# EAGLE schematic UFBmod_2V1 (EAGLE 7.7.0)
UFBmod - the best digital modulation ever created :-)
Assembly variants: Std

## Sheet 1 of 15: FPGA Slot-Left
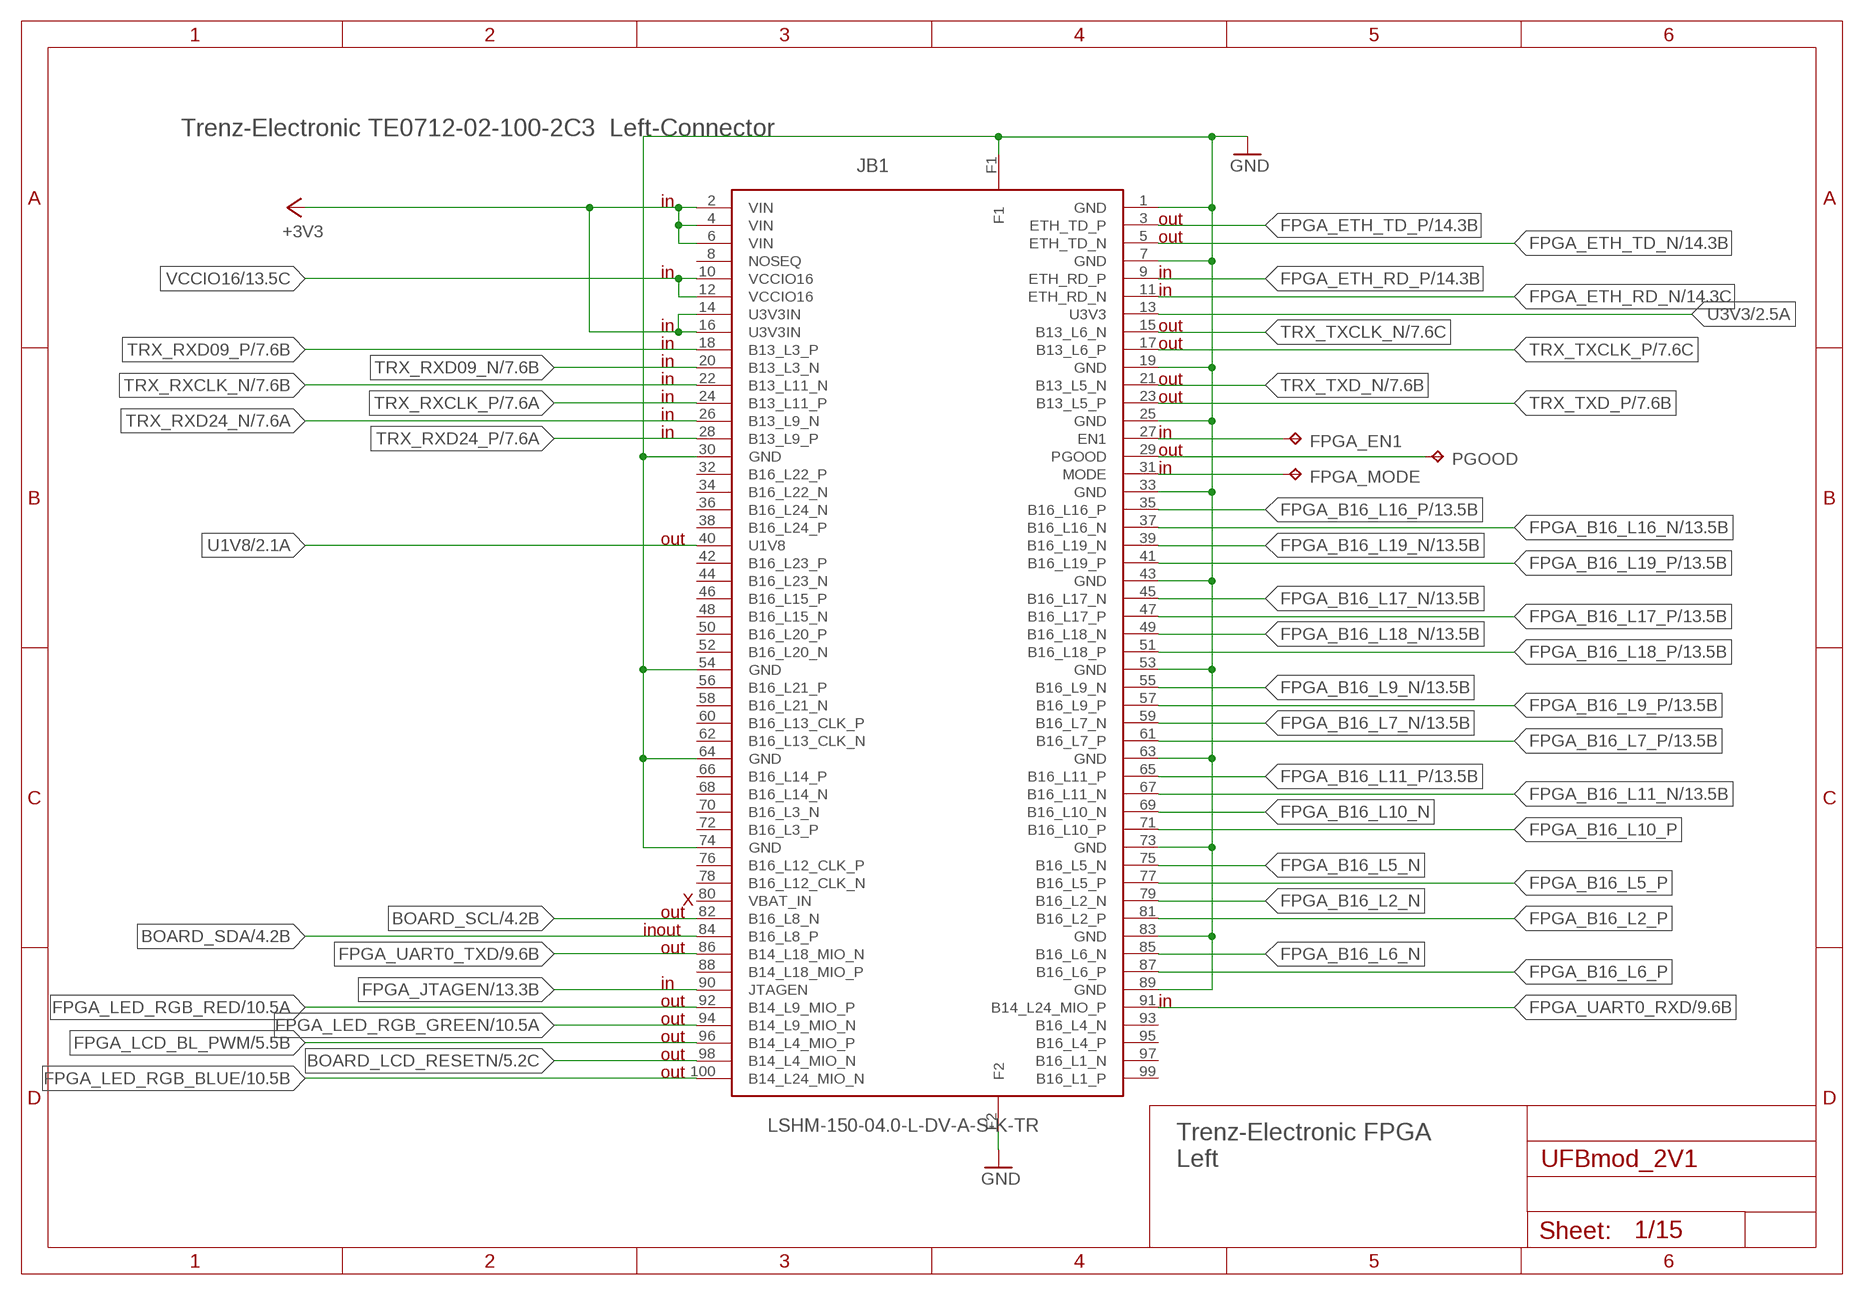
[diagram p0: schematic, sheet 1]

### Parts
FPGA_EN1  TPB1,27  [B1,27]
FPGA_MODE  TPB1,27  [B1,27]
JB1  LSHM-150-04.0-L-DV-A-S-K-TR  SAMTEC_LSHM-150-DV_JB1  [SAMTEC_LSHM-150-DV]
PGOOD  TPB1,27  [B1,27]

### Nets
+3V3: JB1.2(VIN) JB1.4(VIN) JB1.6(VIN) JB1.14(U3V3IN) JB1.16(U3V3IN) ; also sheet 2,4,5,6,7,8,9,11,12,13,14
BOARD_LCD_RESETN: JB1.98(B14_L4_MIO_N) ; also sheet 5
BOARD_SCL: JB1.82(B16_L8_N) ; also sheet 4,5,6
BOARD_SDA: JB1.84(B16_L8_P) ; also sheet 4,5,6
FPGA_B16_L2_N: JB1.79(B16_L2_N)
FPGA_B16_L2_P: JB1.81(B16_L2_P)
FPGA_B16_L5_N: JB1.75(B16_L5_N)
FPGA_B16_L5_P: JB1.77(B16_L5_P)
FPGA_B16_L6_N: JB1.85(B16_L6_N)
FPGA_B16_L6_P: JB1.87(B16_L6_P)
FPGA_B16_L7_N [diff_100R_360u]: JB1.59(B16_L7_N) ; also sheet 13
FPGA_B16_L7_P [diff_100R_360u]: JB1.61(B16_L7_P) ; also sheet 13
FPGA_B16_L9_N: JB1.55(B16_L9_N) ; also sheet 13
FPGA_B16_L9_P [diff_100R_360u]: JB1.57(B16_L9_P) ; also sheet 13
FPGA_B16_L10_N: JB1.69(B16_L10_N)
FPGA_B16_L10_P: JB1.71(B16_L10_P)
FPGA_B16_L11_N [diff_100R_360u]: JB1.67(B16_L11_N) ; also sheet 13
FPGA_B16_L11_P [diff_100R_360u]: JB1.65(B16_L11_P) ; also sheet 13
FPGA_B16_L16_N [diff_100R_360u]: JB1.37(B16_L16_N) ; also sheet 13
FPGA_B16_L16_P [diff_100R_360u]: JB1.35(B16_L16_P) ; also sheet 13
FPGA_B16_L17_N [diff_100R_360u]: JB1.45(B16_L17_N) ; also sheet 13
FPGA_B16_L17_P [diff_100R_360u]: JB1.47(B16_L17_P) ; also sheet 13
FPGA_B16_L18_N [diff_100R_360u]: JB1.49(B16_L18_N) ; also sheet 13
FPGA_B16_L18_P [diff_100R_360u]: JB1.51(B16_L18_P) ; also sheet 13
FPGA_B16_L19_N [diff_100R_360u]: JB1.39(B16_L19_N) ; also sheet 13
FPGA_B16_L19_P [diff_100R_360u]: JB1.41(B16_L19_P) ; also sheet 13
FPGA_EN1: FPGA_EN1.TP JB1.27(EN1)
FPGA_ETH_RD_N [diff_100R_200u]: JB1.11(ETH_RD_N) ; also sheet 14
FPGA_ETH_RD_P [diff_100R_200u]: JB1.9(ETH_RD_P) ; also sheet 14
FPGA_ETH_TD_N [diff_100R_200u]: JB1.5(ETH_TD_N) ; also sheet 14
FPGA_ETH_TD_P [diff_100R_200u]: JB1.3(ETH_TD_P) ; also sheet 14
FPGA_JTAGEN: JB1.90(JTAGEN) ; also sheet 13
FPGA_LCD_BL_PWM: JB1.96(B14_L4_MIO_P) ; also sheet 5
FPGA_LED_RGB_BLUE: JB1.100(B14_L24_MIO_N) ; also sheet 10
FPGA_LED_RGB_GREEN: JB1.94(B14_L9_MIO_N) ; also sheet 10
FPGA_LED_RGB_RED: JB1.92(B14_L9_MIO_P) ; also sheet 10
FPGA_MODE: FPGA_MODE.TP JB1.31(MODE)
FPGA_UART0_RXD: JB1.91(B14_L24_MIO_P) ; also sheet 9
FPGA_UART0_TXD: JB1.86(B14_L18_MIO_N) ; also sheet 9
GND: JB1.1(GND) JB1.7(GND) JB1.19(GND) JB1.25(GND) JB1.30(GND) JB1.33(GND) JB1.43(GND) JB1.53(GND) JB1.54(GND) JB1.63(GND) JB1.64(GND) JB1.73(GND) JB1.74(GND) JB1.83(GND) JB1.89(GND) JB1.F1 JB1.F2 ; also sheet 2,3,5,6,7,8,9,10,11,12,13,14,15
PGOOD: JB1.29(PGOOD) PGOOD.TP
TRX_RXCLK_N [diff_100R_200u]: JB1.22(B13_L11_N) ; also sheet 7
TRX_RXCLK_P [diff_100R_200u]: JB1.24(B13_L11_P) ; also sheet 7
TRX_RXD09_N [diff_100R_200u]: JB1.20(B13_L3_N) ; also sheet 7
TRX_RXD09_P [diff_100R_200u]: JB1.18(B13_L3_P) ; also sheet 7
TRX_RXD24_N [diff_100R_200u]: JB1.26(B13_L9_N) ; also sheet 7
TRX_RXD24_P [diff_100R_200u]: JB1.28(B13_L9_P) ; also sheet 7
TRX_TXCLK_N [diff_100R_200u]: JB1.15(B13_L6_N) ; also sheet 7
TRX_TXCLK_P [diff_100R_200u]: JB1.17(B13_L6_P) ; also sheet 7
TRX_TXD_N [diff_100R_200u]: JB1.21(B13_L5_N) ; also sheet 7
TRX_TXD_P [diff_100R_200u]: JB1.23(B13_L5_P) ; also sheet 7
U1V8: JB1.40(U1V8) ; also sheet 2,13
U3V3: JB1.13(U3V3) ; also sheet 2,12,13
VCCIO16: JB1.10(VCCIO16) JB1.12(VCCIO16) ; also sheet 13
Unconnected: JB1.8(NOSEQ) JB1.32(B16_L22_P) JB1.34(B16_L22_N) JB1.36(B16_L24_N) JB1.38(B16_L24_P) JB1.42(B16_L23_P) JB1.44(B16_L23_N) JB1.46(B16_L15_P) JB1.48(B16_L15_N) JB1.50(B16_L20_P) JB1.52(B16_L20_N) JB1.56(B16_L21_P) JB1.58(B16_L21_N) JB1.60(B16_L13_CLK_P) JB1.62(B16_L13_CLK_N) JB1.66(B16_L14_P) JB1.68(B16_L14_N) JB1.70(B16_L3_N) JB1.72(B16_L3_P) JB1.76(B16_L12_CLK_P) JB1.78(B16_L12_CLK_N) JB1.88(B14_L18_MIO_P) JB1.93(B16_L4_N) JB1.95(B16_L4_P) JB1.97(B16_L1_N) JB1.99(B16_L1_P)

### Notes on the sheet
- Trenz-Electronic TE0712-02-100-2C3  Left-Connector
- in
- out
- out
- in | in
- in
- in | out
- in | out
- in
- in | out
- in | out
- in
- in | in
- out
- in
- out
- X
- out
- inout
- out
- in
- out | in
- out
- out
- out
- out
- Trenz-Electronic FPGA
  Left

## Sheet 2 of 15: FPGA Slot-Right
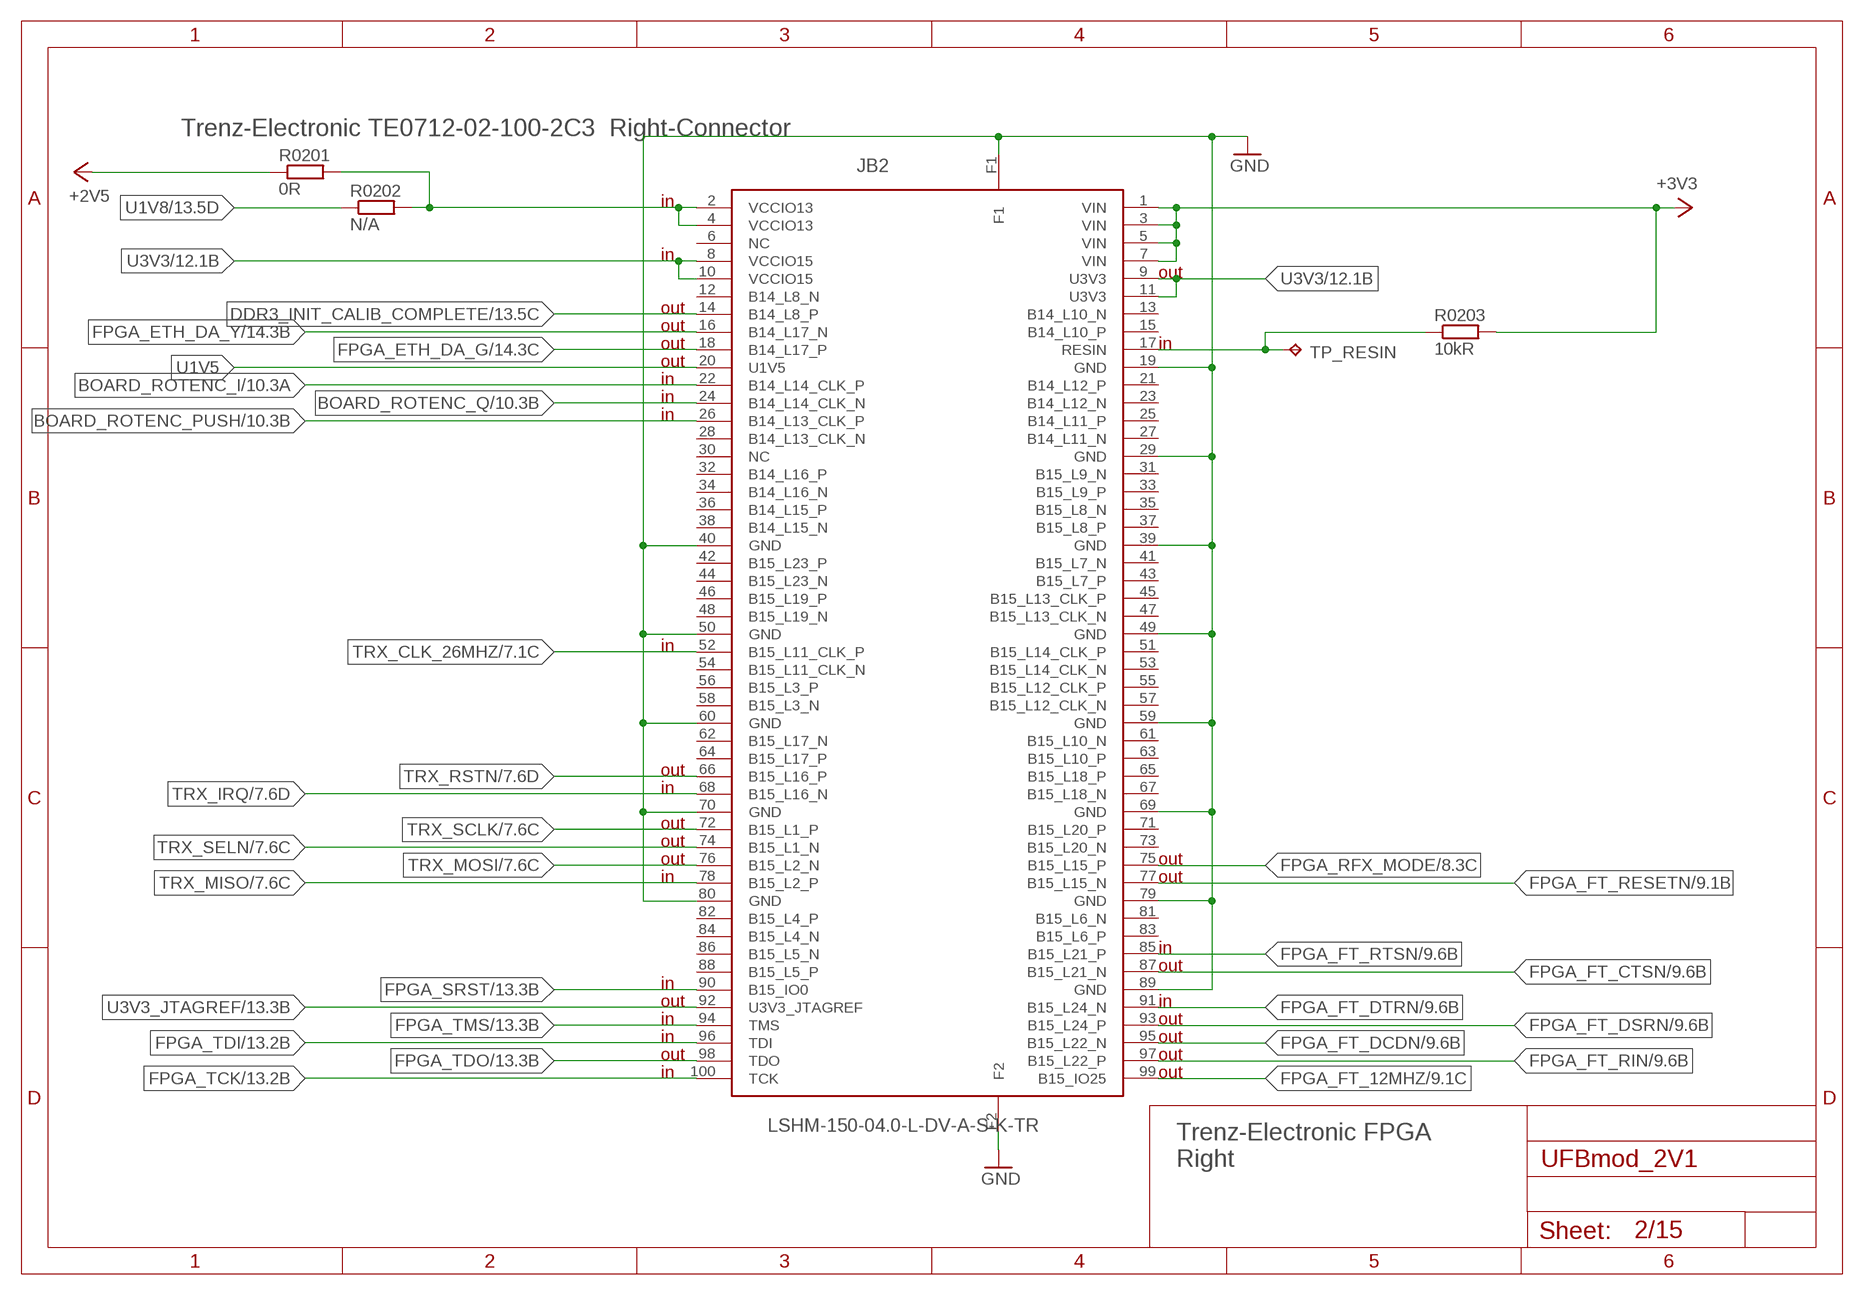
[diagram p1: schematic, sheet 2]

### Parts
JB2  LSHM-150-04.0-L-DV-A-S-K-TR  SAMTEC_LSHM-150-DV_JB2  [SAMTEC_LSHM-150-DV]
R0201  0R  R-EU_R0402  [R0402]
R0202  N/A  R-EU_R0402  [R0402]  (not fitted in variant Std)
R0203  10kR  R-EU_R0402  [R0402]
TP_RESIN  TPB1,27  [B1,27]

### Nets
+2V5: R0201.1 ; also sheet 12,13
+3V3: JB2.1(VIN) JB2.3(VIN) JB2.5(VIN) JB2.7(VIN) R0203.2 ; also sheet 1,4,5,6,7,8,9,11,12,13,14
BOARD_ROTENC_I: JB2.22(B14_L14_CLK_P) ; also sheet 10
BOARD_ROTENC_PUSH: JB2.26(B14_L13_CLK_P) ; also sheet 10
BOARD_ROTENC_Q: JB2.24(B14_L14_CLK_N) ; also sheet 10
DDR3_INIT_CALIB_COMPLETE: JB2.14(B14_L8_P) ; also sheet 13
FPGA_ETH_DA_G: JB2.18(B14_L17_P) ; also sheet 14
FPGA_ETH_DA_Y: JB2.16(B14_L17_N) ; also sheet 14
FPGA_FT_12MHZ: JB2.99(B15_IO25) ; also sheet 9
FPGA_FT_CTSN: JB2.87(B15_L21_N) ; also sheet 9
FPGA_FT_DCDN: JB2.95(B15_L22_N) ; also sheet 9
FPGA_FT_DSRN: JB2.93(B15_L24_P) ; also sheet 9
FPGA_FT_DTRN: JB2.91(B15_L24_N) ; also sheet 9
FPGA_FT_RESETN: JB2.77(B15_L15_N) ; also sheet 9
FPGA_FT_RIN: JB2.97(B15_L22_P) ; also sheet 9
FPGA_FT_RTSN: JB2.85(B15_L21_P) ; also sheet 9
FPGA_RFX_MODE: JB2.75(B15_L15_P) ; also sheet 8
FPGA_SRST: JB2.90(B15_IO0) ; also sheet 13
FPGA_TCK: JB2.100(TCK) ; also sheet 13
FPGA_TDI: JB2.96(TDI) ; also sheet 13
FPGA_TDO: JB2.98(TDO) ; also sheet 13
FPGA_TMS: JB2.94(TMS) ; also sheet 13
GND: JB2.19(GND) JB2.29(GND) JB2.39(GND) JB2.40(GND) JB2.49(GND) JB2.50(GND) JB2.59(GND) JB2.60(GND) JB2.69(GND) JB2.70(GND) JB2.79(GND) JB2.80(GND) JB2.89(GND) JB2.F1 JB2.F2 ; also sheet 1,3,5,6,7,8,9,10,11,12,13,14,15
RESIN: JB2.17(RESIN) R0203.1 TP_RESIN.TP
TRX_CLK_26MHZ: JB2.52(B15_L11_CLK_P) ; also sheet 7
TRX_IRQ: JB2.68(B15_L16_N) ; also sheet 7
TRX_MISO: JB2.78(B15_L2_P) ; also sheet 7
TRX_MOSI: JB2.76(B15_L2_N) ; also sheet 7
TRX_RSTN: JB2.66(B15_L16_P) ; also sheet 7
TRX_SCLK: JB2.72(B15_L1_P) ; also sheet 7
TRX_SELN: JB2.74(B15_L1_N) ; also sheet 7
U1V5: JB2.20(U1V5)
U1V8: R0202.1 ; also sheet 1,13
U3V3: JB2.8(VCCIO15) JB2.9(U3V3) JB2.10(VCCIO15) JB2.11(U3V3) ; also sheet 1,12,13
U3V3_JTAGREF: JB2.92(U3V3_JTAGREF) ; also sheet 13
VCCIO13: JB2.2(VCCIO13) JB2.4(VCCIO13) R0201.2 R0202.2 ; also sheet 13
Unconnected: JB2.6(NC) JB2.12(B14_L8_N) JB2.13(B14_L10_N) JB2.15(B14_L10_P) JB2.21(B14_L12_P) JB2.23(B14_L12_N) JB2.25(B14_L11_P) JB2.27(B14_L11_N) JB2.28(B14_L13_CLK_N) JB2.30(NC) JB2.31(B15_L9_N) JB2.32(B14_L16_P) JB2.33(B15_L9_P) JB2.34(B14_L16_N) JB2.35(B15_L8_N) JB2.36(B14_L15_P) JB2.37(B15_L8_P) JB2.38(B14_L15_N) JB2.41(B15_L7_N) JB2.42(B15_L23_P) JB2.43(B15_L7_P) JB2.44(B15_L23_N) JB2.45(B15_L13_CLK_P) JB2.46(B15_L19_P) JB2.47(B15_L13_CLK_N) JB2.48(B15_L19_N) JB2.51(B15_L14_CLK_P) JB2.53(B15_L14_CLK_N) JB2.54(B15_L11_CLK_N) JB2.55(B15_L12_CLK_P) JB2.56(B15_L3_P) JB2.57(B15_L12_CLK_N) JB2.58(B15_L3_N) JB2.61(B15_L10_N) JB2.62(B15_L17_N) JB2.63(B15_L10_P) JB2.64(B15_L17_P) JB2.65(B15_L18_P) JB2.67(B15_L18_N) JB2.71(B15_L20_P) JB2.73(B15_L20_N) JB2.81(B15_L6_N) JB2.82(B15_L4_P) JB2.83(B15_L6_P) JB2.84(B15_L4_N) JB2.86(B15_L5_N) JB2.88(B15_L5_P)

### Notes on the sheet
- Trenz-Electronic TE0712-02-100-2C3  Right-Connector
- in
- in
- out
- out
- out
- out | in
- out
- in
- in
- in
- in
- out
- in
- out
- out
- out | out
- in | out
- in
- out
- in
- out | in
- in | out
- in | out
- out | out
- in | out
- Trenz-Electronic FPGA
  Right

## Sheet 3 of 15: FPGA Slot-Top
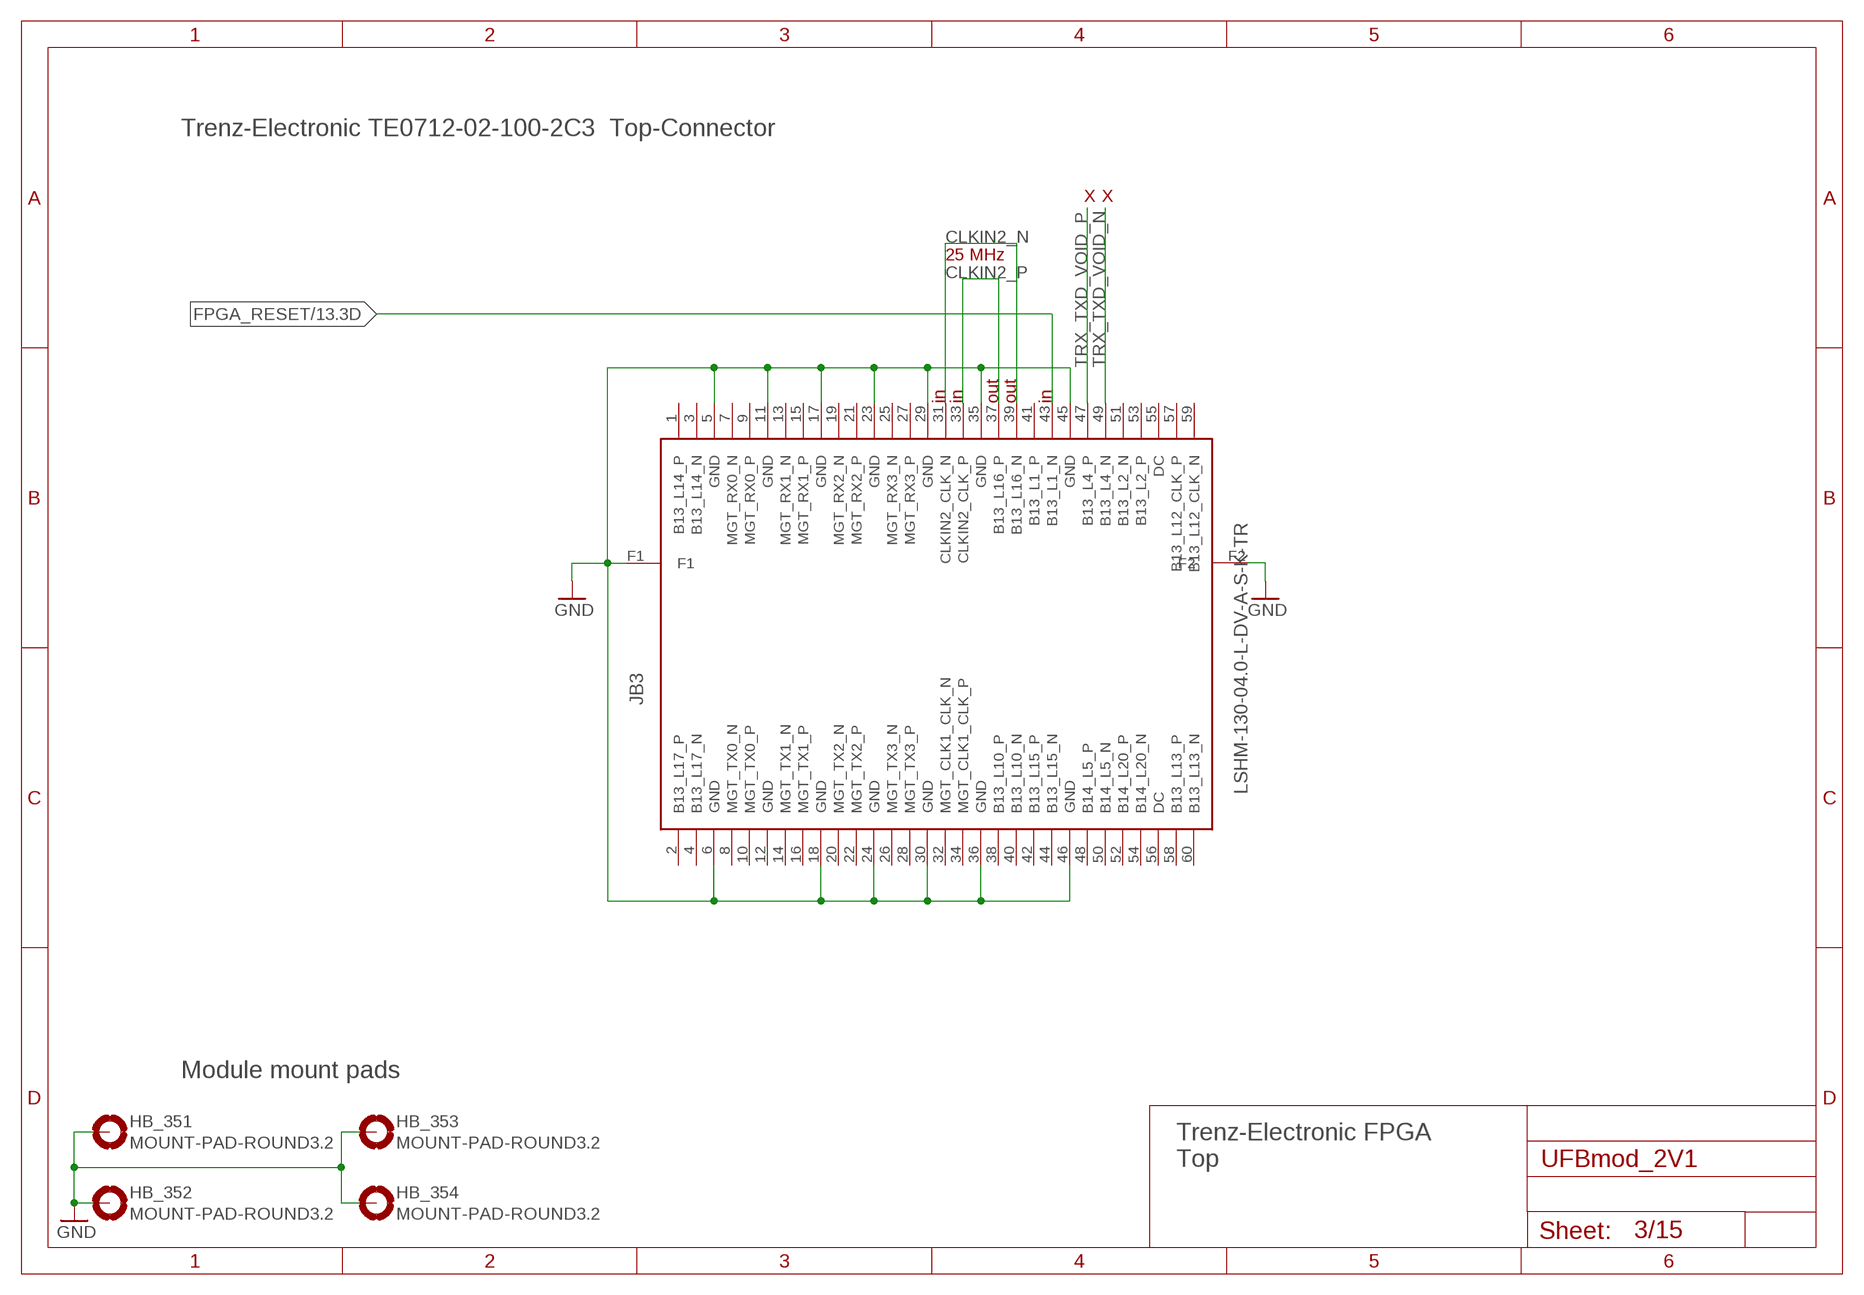
[diagram p2: schematic, sheet 3]

### Parts
HB_351  MOUNT-PAD-ROUND3.2  [3,2-PAD]
HB_352  MOUNT-PAD-ROUND3.2  [3,2-PAD]
HB_353  MOUNT-PAD-ROUND3.2  [3,2-PAD]
HB_354  MOUNT-PAD-ROUND3.2  [3,2-PAD]
JB3  LSHM-130-04.0-L-DV-A-S-K-TR  SAMTEC_LSHM-130-DV_JB3  [SAMTEC_LSHM-130-DV]

### Nets
CLKIN2_N: JB3.31(CLKIN2_CLK_N) JB3.39(B13_L16_N)
CLKIN2_P: JB3.33(CLKIN2_CLK_P) JB3.37(B13_L16_P)
FPGA_RESET: JB3.43(B13_L1_N) ; also sheet 13
GND: HB_351.B3,2(MOUNT) HB_352.B3,2(MOUNT) HB_353.B3,2(MOUNT) HB_354.B3,2(MOUNT) JB3.5(GND) JB3.6(GND) JB3.11(GND) JB3.17(GND) JB3.18(GND) JB3.23(GND) JB3.24(GND) JB3.29(GND) JB3.30(GND) JB3.35(GND) JB3.36(GND) JB3.45(GND) JB3.46(GND) JB3.F1 JB3.F2 ; also sheet 1,2,5,6,7,8,9,10,11,12,13,14,15
TRX_TXD_VOID_N [diff_100R_200u]: JB3.49(B13_L4_N)
TRX_TXD_VOID_P [diff_100R_200u]: JB3.47(B13_L4_P)
Unconnected: JB3.1(B13_L14_P) JB3.2(B13_L17_P) JB3.3(B13_L14_N) JB3.4(B13_L17_N) JB3.7(MGT_RX0_N) JB3.8(MGT_TX0_N) JB3.9(MGT_RX0_P) JB3.10(MGT_TX0_P) JB3.12(GND) JB3.13(MGT_RX1_N) JB3.14(MGT_TX1_N) JB3.15(MGT_RX1_P) JB3.16(MGT_TX1_P) JB3.19(MGT_RX2_N) JB3.20(MGT_TX2_N) JB3.21(MGT_RX2_P) JB3.22(MGT_TX2_P) JB3.25(MGT_RX3_N) JB3.26(MGT_TX3_N) JB3.27(MGT_RX3_P) JB3.28(MGT_TX3_P) JB3.32(MGT_CLK1_CLK_N) JB3.34(MGT_CLK1_CLK_P) JB3.38(B13_L10_P) JB3.40(B13_L10_N) JB3.41(B13_L1_P) JB3.42(B13_L15_P) JB3.44(B13_L15_N) JB3.48(B14_L5_P) JB3.50(B14_L5_N) JB3.51(B13_L2_N) JB3.52(B14_L20_P) JB3.53(B13_L2_P) JB3.54(B14_L20_N) JB3.55(DC) JB3.56(DC) JB3.57(B13_L12_CLK_P) JB3.58(B13_L13_P) JB3.59(B13_L12_CLK_N) JB3.60(B13_L13_N)

### Notes on the sheet
- Trenz-Electronic TE0712-02-100-2C3  Top-Connector
- X | X
- 25 MHz
- in | in | out | out | in
- Module mount pads
- Trenz-Electronic FPGA
  Top

## Sheet 4 of 15: I2C - Termination
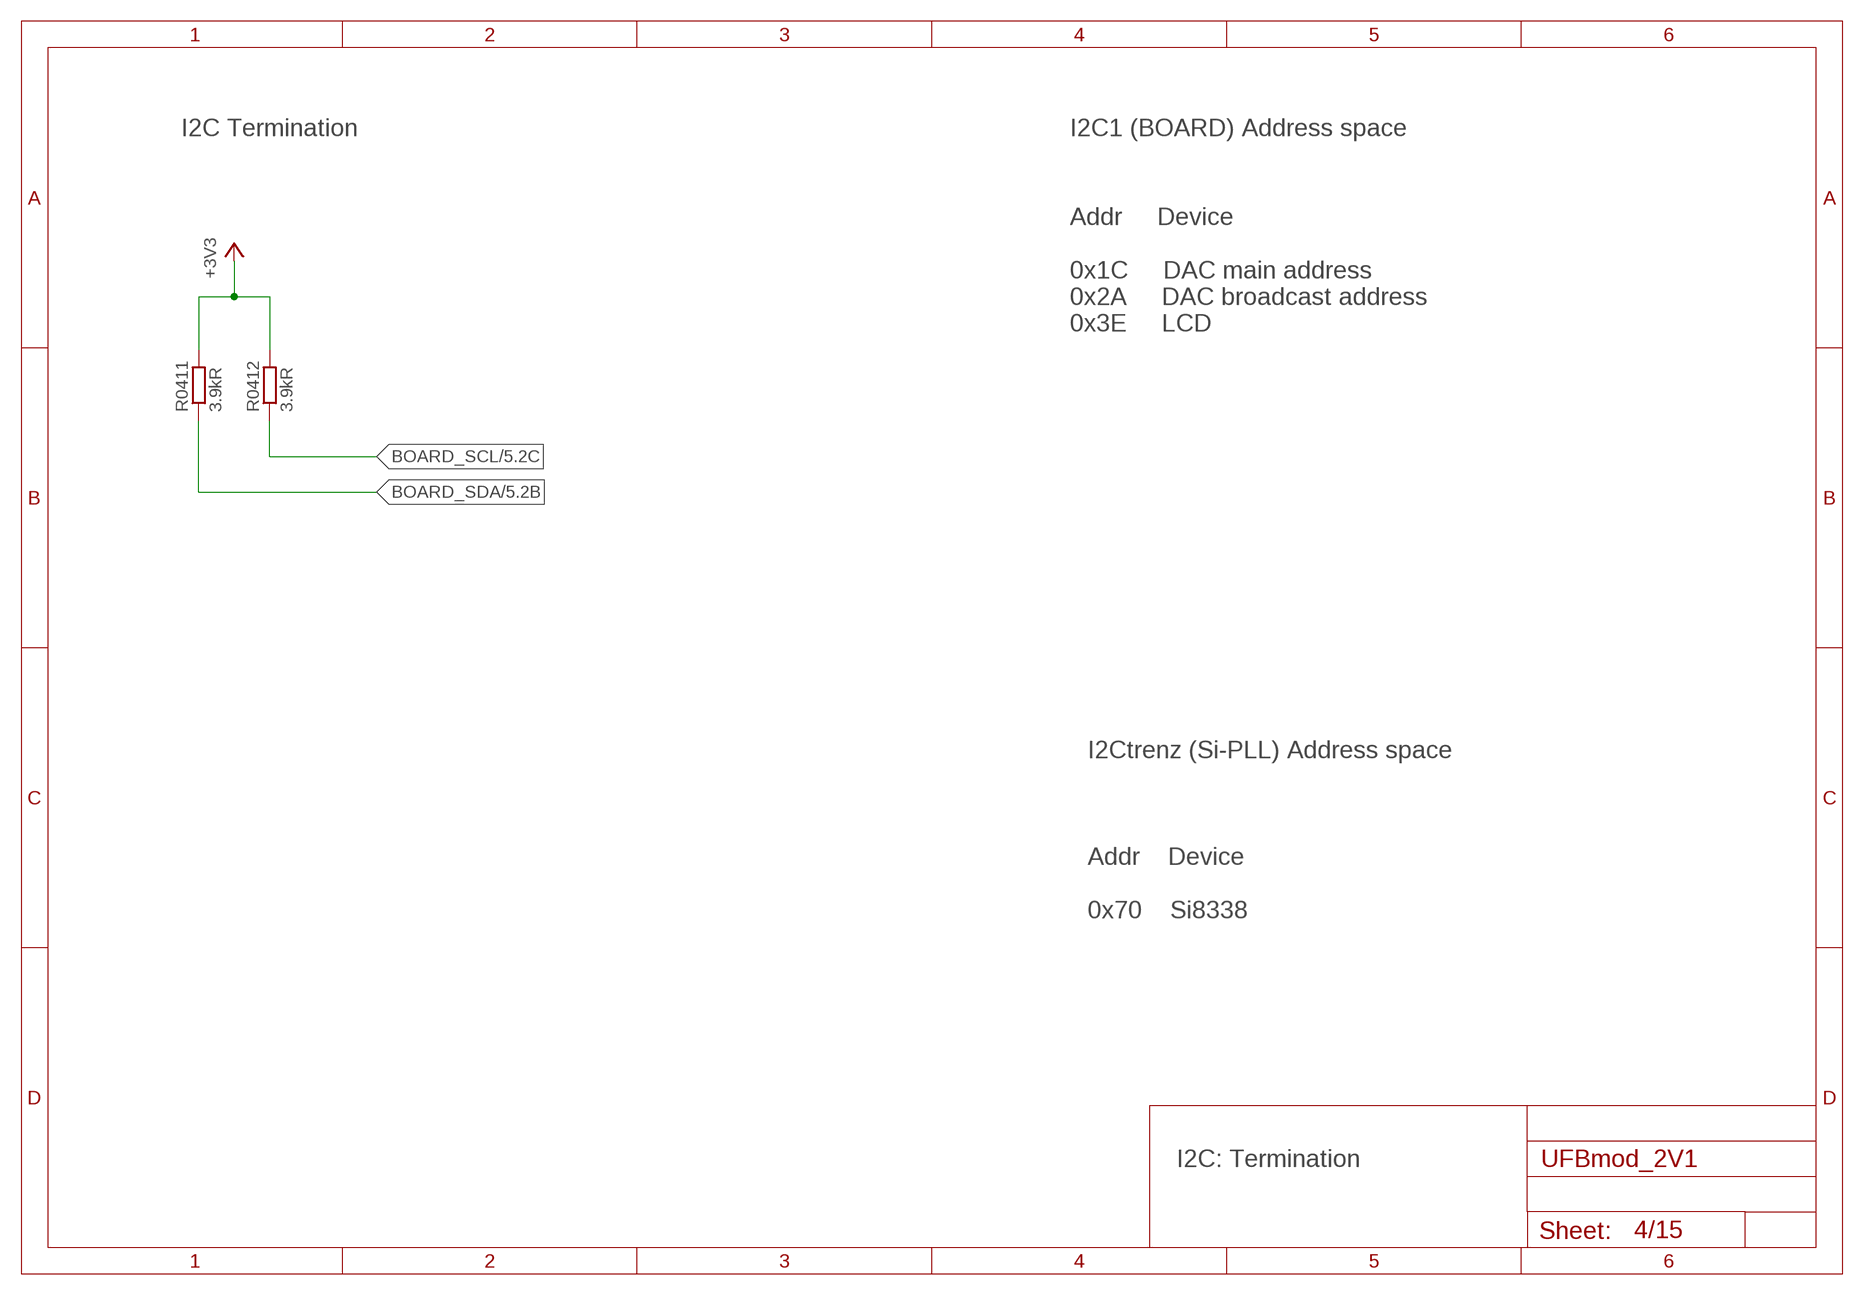
[diagram p3: schematic, sheet 4]

### Parts
R0411  3.9kR  R-EU_R0402  [R0402]
R0412  3.9kR  R-EU_R0402  [R0402]

### Nets
+3V3: R0411.2 R0412.2 ; also sheet 1,2,5,6,7,8,9,11,12,13,14
BOARD_SCL: R0412.1 ; also sheet 1,5,6
BOARD_SDA: R0411.1 ; also sheet 1,5,6

### Notes on the sheet
- I2C Termination | I2C1 (BOARD) Address space
- Addr     Device
  
  0x1C     DAC main address
  0x2A     DAC broadcast address
  0x3E     LCD
- I2Ctrenz (Si-PLL) Address space
- Addr    Device
  
  0x70    Si8338
- I2C: Termination

## Sheet 5 of 15: I2C LCD
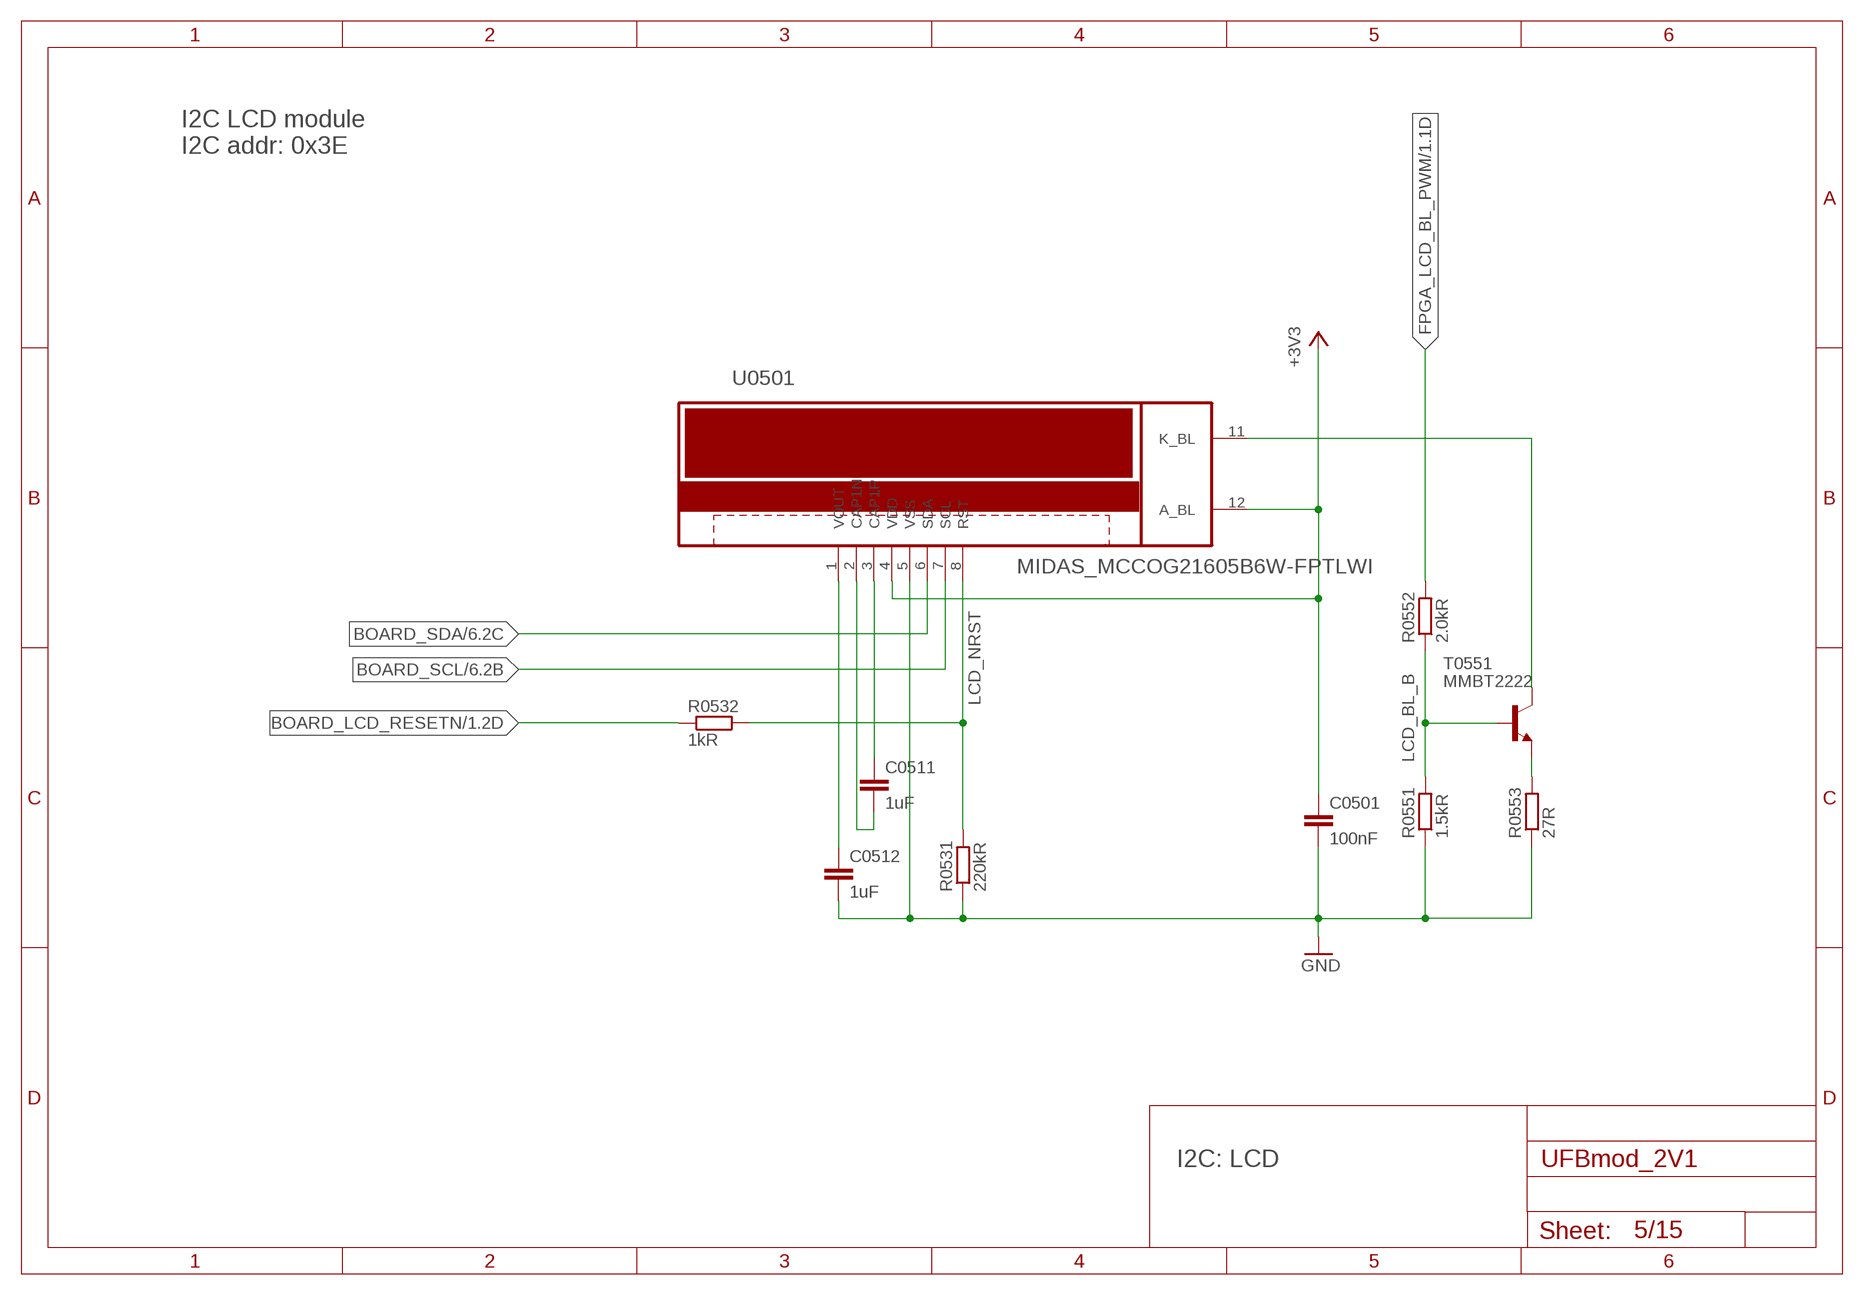
[diagram p4: schematic, sheet 5]

### Parts
C0501  100nF  C-EUC0402  [C0402]
C0511  1uF  C-EUC0402  [C0402]
C0512  1uF  C-EUC0402  [C0402]
R0531  220kR  R-EU_R0402  [R0402]
R0532  1kR  R-EU_R0402  [R0402]
R0551  1.5kR  R-EU_R0402  [R0402]
R0552  2.0kR  R-EU_R0402  [R0402]
R0553  27R  R-EU_R0603  [R0603]
T0551  MMBT2222  BC846  [SOT23]
U0501  MIDAS_MCCOG21605B6W-FPTLWI  [MIDAS_MCCOG21605B6W-FPTLWI]

### Nets
+3V3: C0501.1 U0501.4(VDD) U0501.12(A_BL) ; also sheet 1,2,4,6,7,8,9,11,12,13,14
BOARD_LCD_RESETN: R0532.1 ; also sheet 1
BOARD_SCL: U0501.7(SCL) ; also sheet 1,4,6
BOARD_SDA: U0501.6(SDA) ; also sheet 1,4,6
FPGA_LCD_BL_PWM: R0552.2 ; also sheet 1
GND: C0501.2 C0512.2 R0531.1 R0551.1 R0553.1 U0501.5(VSS) ; also sheet 1,2,3,6,7,8,9,10,11,12,13,14,15
LCD_BL_B: R0551.2 R0552.1 T0551.1(B)
LCD_BL_K: T0551.3(C) U0501.11(K_BL)
LCD_CAP1N: C0511.2 U0501.2(CAP1N)
LCD_CAP1P: C0511.1 U0501.3(CAP1P)
LCD_NRST: R0531.2 R0532.2 U0501.8(RST)
LCD_VOUT: C0512.1 U0501.1(VOUT)
LED_B_E: R0553.2 T0551.2(E)

### Notes on the sheet
- I2C LCD module
  I2C addr: 0x3E
- I2C: LCD

## Sheet 6 of 15: I2C - DAC
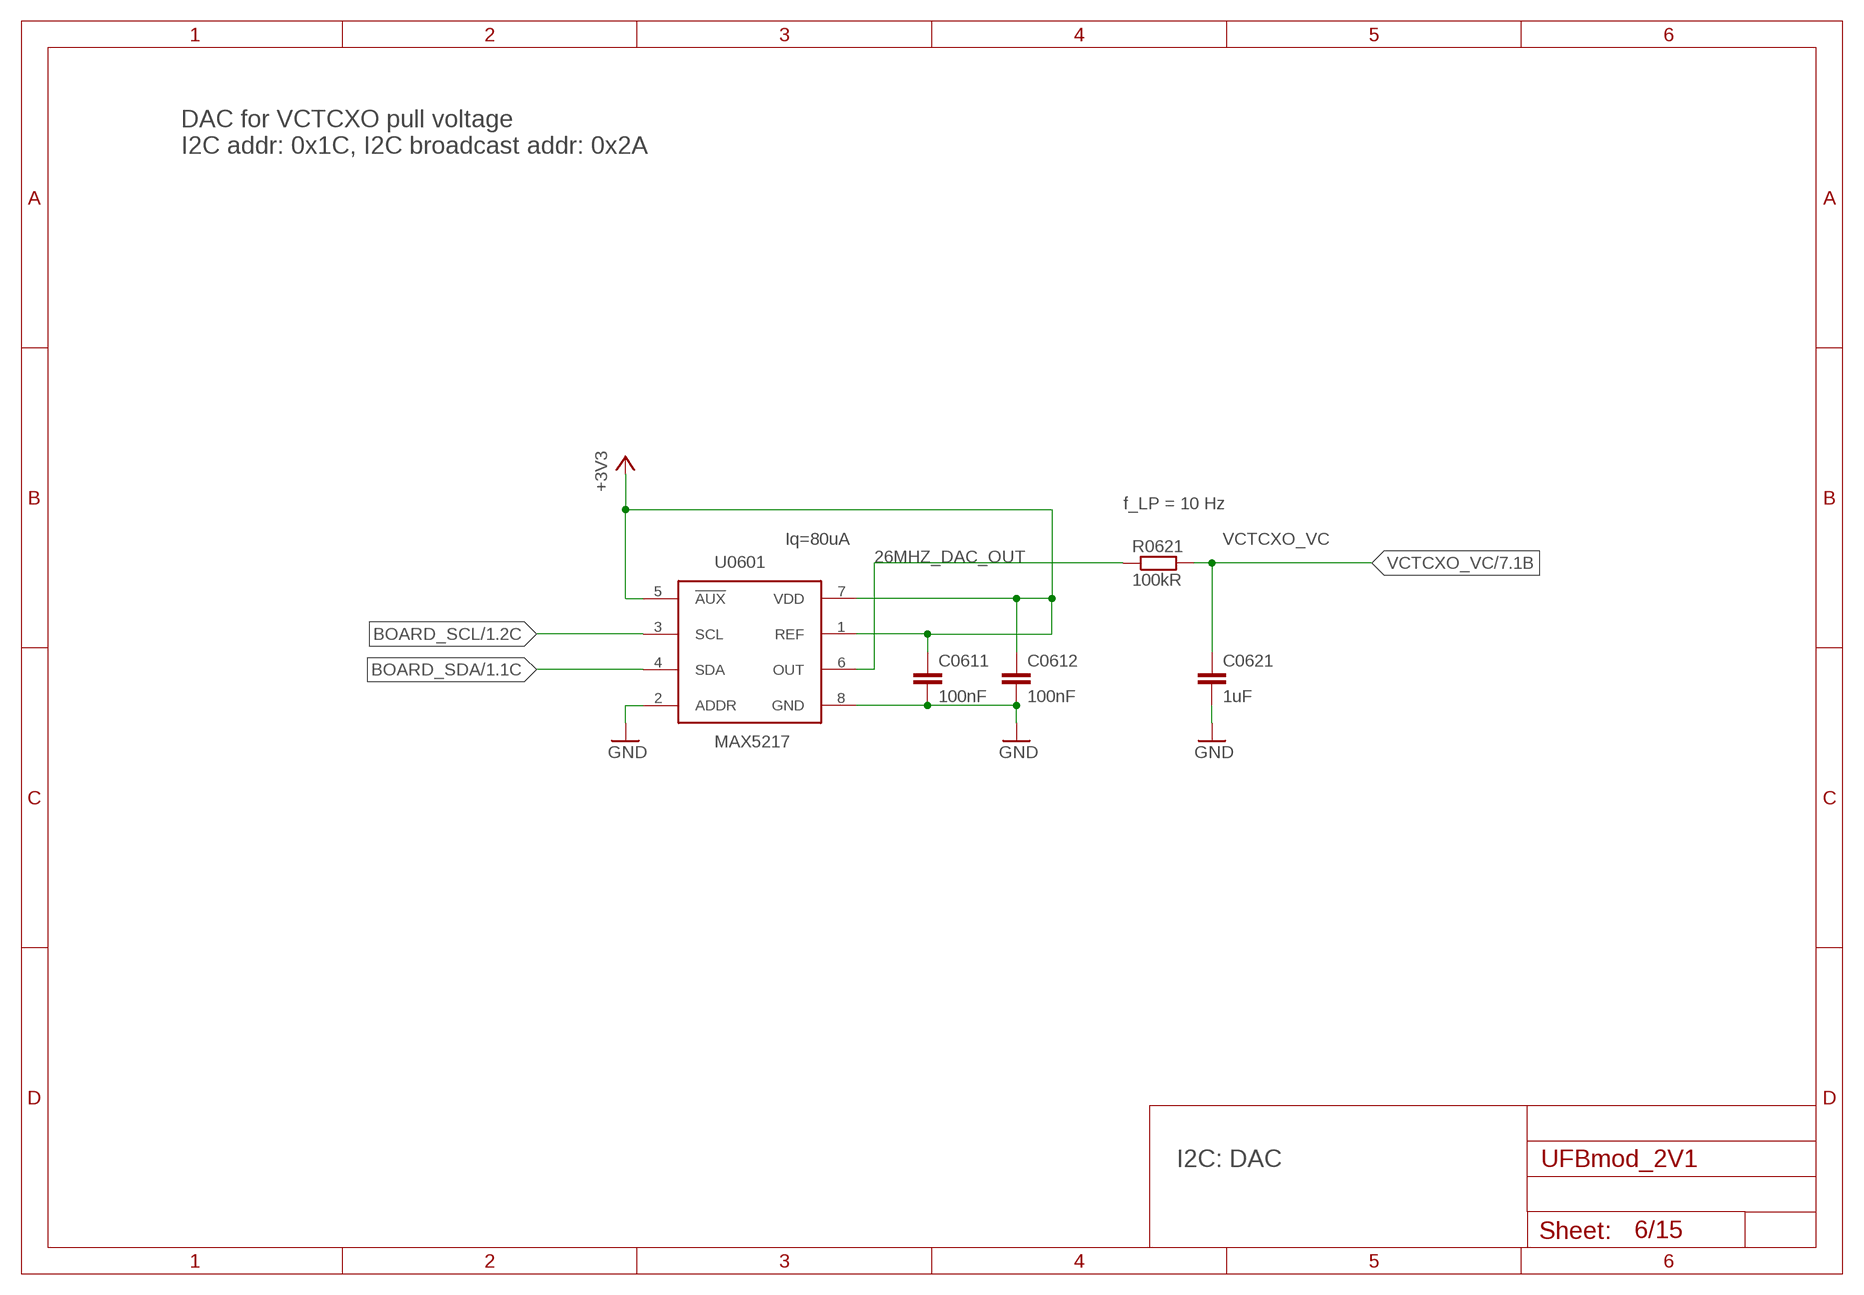
[diagram p5: schematic, sheet 6]

### Parts
C0611  100nF  C-EUC0402  [C0402]
C0612  100nF  C-EUC0402  [C0402]
C0621  1uF  C-EUC0402  [C0402]
R0621  100kR  R-EU_R0402  [R0402]
U0601  MAX5217  [µMAX8]

### Nets
26MHZ_DAC_OUT: R0621.1 U0601.6(OUT)
+3V3: C0611.1 C0612.1 U0601.1(REF) U0601.5(!AUX) U0601.7(VDD) ; also sheet 1,2,4,5,7,8,9,11,12,13,14
BOARD_SCL: U0601.3(SCL) ; also sheet 1,4,5
BOARD_SDA: U0601.4(SDA) ; also sheet 1,4,5
GND: C0611.2 C0612.2 C0621.2 U0601.2(ADDR) U0601.8(GND) ; also sheet 1,2,3,5,7,8,9,10,11,12,13,14,15
VCTCXO_VC: C0621.1 R0621.2 ; also sheet 7

### Notes on the sheet
- DAC for VCTCXO pull voltage
  I2C addr: 0x1C, I2C broadcast addr: 0x2A
- f_LP = 10 Hz
- Iq=80uA
- I2C: DAC

## Sheet 7 of 15: SPI - TRX
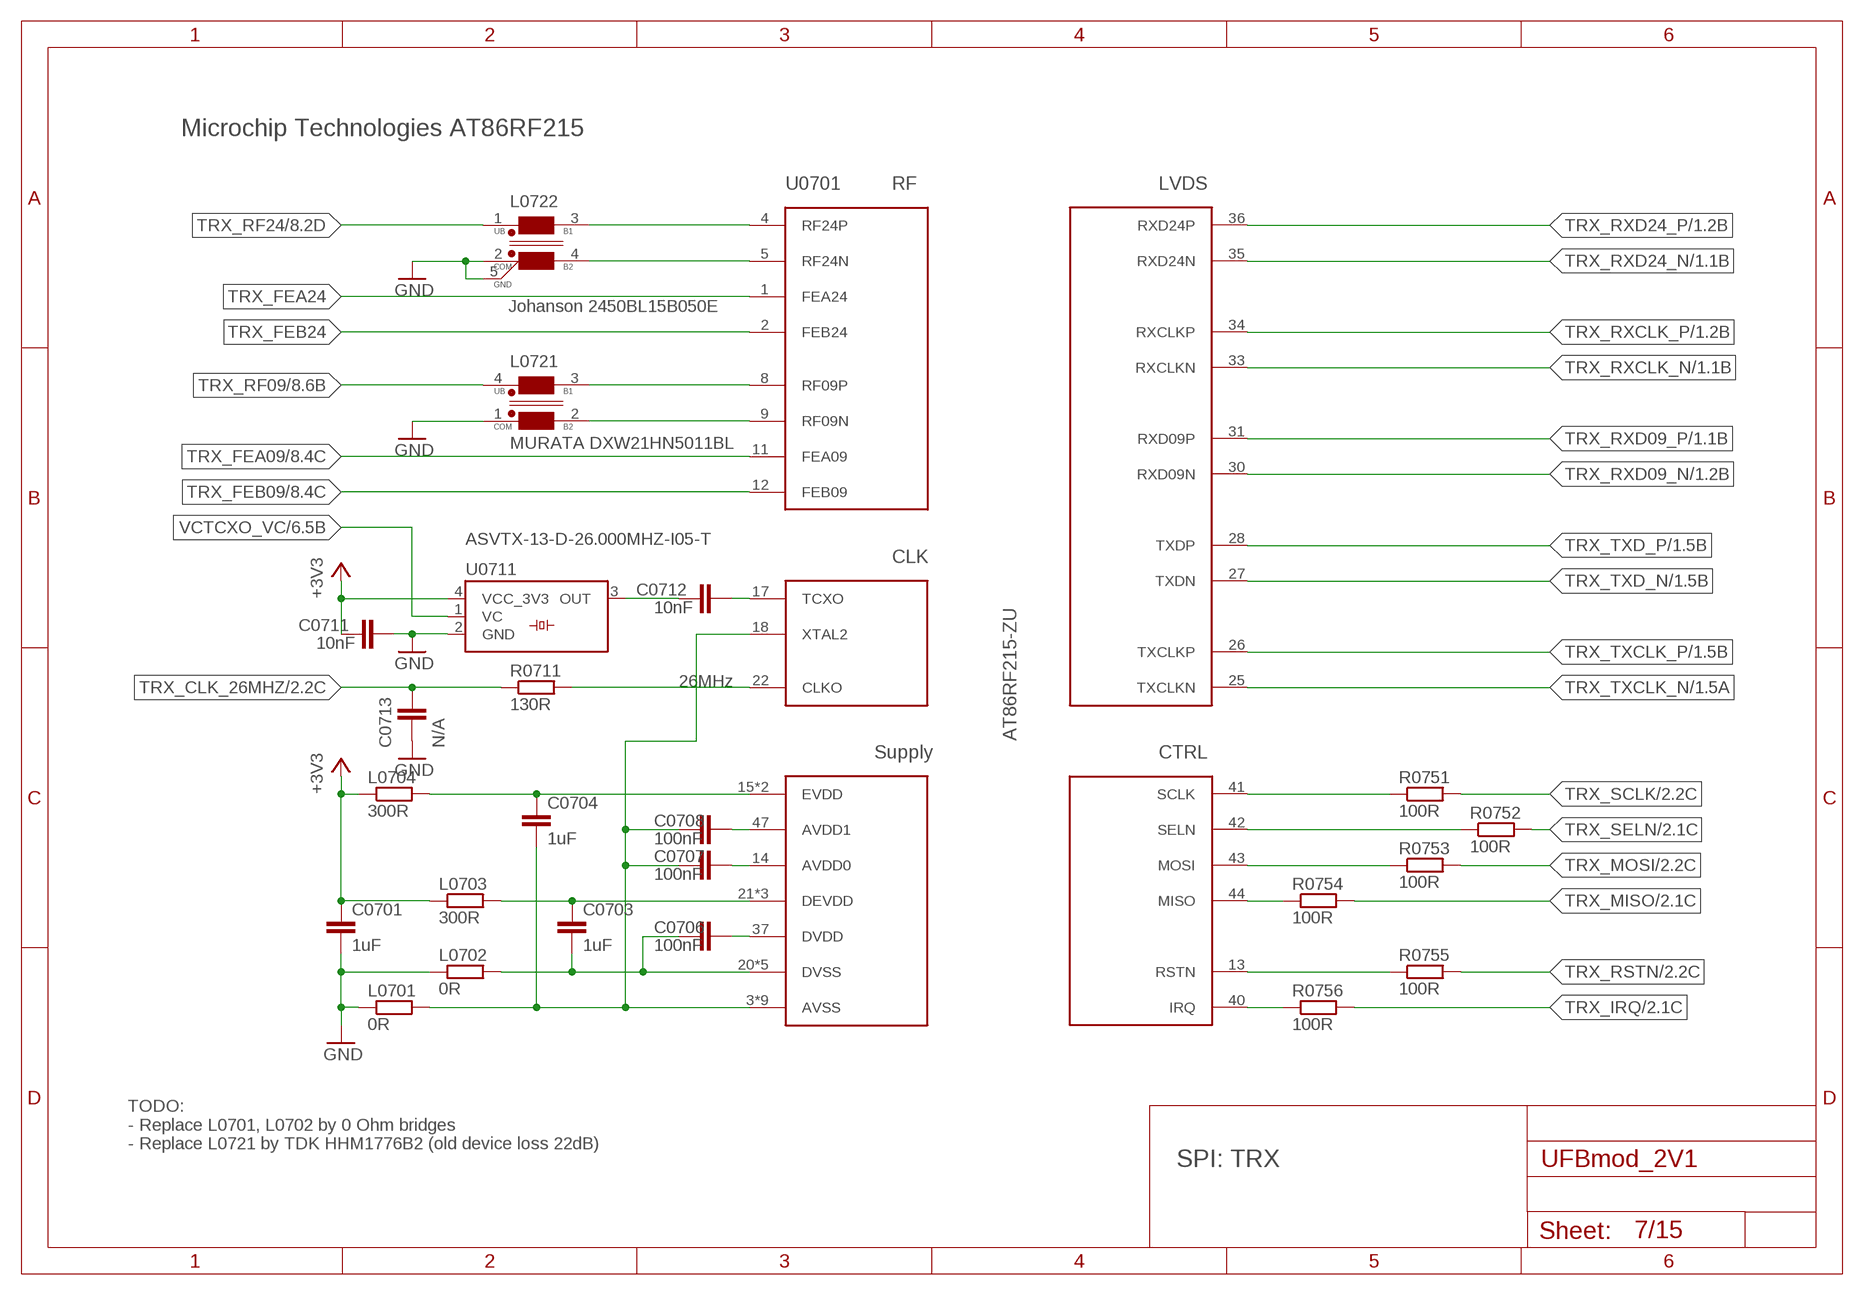
[diagram p6: schematic, sheet 7]

### Parts
C0701  1uF  C-EUC0402  [C0402]
C0703  1uF  C-EUC0402  [C0402]
C0704  1uF  C-EUC0402  [C0402]
C0706  100nF  C-EUC0402  [C0402]
C0707  100nF  C-EUC0402  [C0402]
C0708  100nF  C-EUC0402  [C0402]
C0711  10nF  C-EUC0402  [C0402]
C0712  10nF  C-EUC0402  [C0402]
C0713  N/A  C-EUC0402  [C0402]
L0701  0R  R-EU_R1206  [R1206]
L0702  0R  R-EU_R1206  [R1206]
L0703  300R  R-EU_R1206  [R1206]
L0704  300R  R-EU_R1206  [R1206]
L0721  MURATA DXW21HN5011BL  DXW21HN5011BL  [DXW21HN5011BL]
L0722  Johanson 2450BL15B050E  2450BL15B050  [2450BL15B050]  (not fitted in variant Std)
R0711  130R  R-EU_R0402  [R0402]
R0751  100R  R-EU_R0402  [R0402]
R0752  100R  R-EU_R0402  [R0402]
R0753  100R  R-EU_R0402  [R0402]
R0754  100R  R-EU_R0402  [R0402]
R0755  100R  R-EU_R0402  [R0402]
R0756  100R  R-EU_R0402  [R0402]
U0701  AT86RF215-ZU  AT86RF215  [QFN48_7X7-0P5-PAD]
U0711  ASVTX-13-D-26.000MHZ-I05-T  ASVTX-13-D  [ASVTX-13]

### Nets
+3V3: C0701.1 C0711.1 L0703.1 L0704.1 U0711.4(VCC_3V3) ; also sheet 1,2,4,5,6,8,9,11,12,13,14
GND: C0701.2 C0711.2 C0713.1 L0701.1 L0702.1 L0721.1(COM) L0722.2(COM) L0722.5(G_N_D) U0711.2(GND) ; also sheet 1,2,3,5,6,8,9,10,11,12,13,14,15
TRX_AVDD0: C0707.2 U0701.14(AVDD0)
TRX_AVDD1: C0708.2 U0701.47(AVDD1)
TRX_AVSS: C0704.2 C0707.1 C0708.1 L0701.2 U0701.3(AVSS) U0701.6(AVSS) U0701.7(AVSS) U0701.10(AVSS) U0701.16(AVSS) U0701.18(XTAL2) U0701.19(AVSS) U0701.45(AVSS) U0701.48(AVSS) U0701.49(AVSS)
TRX_CLK_26MHZ: C0713.2 R0711.1 ; also sheet 2
TRX_CLKO_26MHZ_R: R0711.2 U0701.22(CLKO)
TRX_DEVDD: C0703.1 L0703.2 U0701.21(DEVDD) U0701.29(DEVDD) U0701.39(DEVDD)
TRX_DVDD: C0706.2 U0701.37(DVDD)
TRX_DVSS: C0703.2 C0706.1 L0702.2 U0701.20(DVSS) U0701.23(DVSS) U0701.24(DVSS) U0701.32(DVSS) U0701.38(DVSS)
TRX_EVDD: C0704.1 L0704.2 U0701.15(EVDD) U0701.46(EVDD)
TRX_FEA09: U0701.11(FEA09) ; also sheet 8
TRX_FEA24: U0701.1(FEA24)
TRX_FEB09: U0701.12(FEB09) ; also sheet 8
TRX_FEB24: U0701.2(FEB24)
TRX_IRQ: R0756.2 ; also sheet 2
TRX_IRQ_R: R0756.1 U0701.40(IRQ)
TRX_MISO: R0754.2 ; also sheet 2
TRX_MISO_R: R0754.1 U0701.44(MISO)
TRX_MOSI: R0753.2 ; also sheet 2
TRX_MOSI_R: R0753.1 U0701.43(MOSI)
TRX_RF09 [uni_50R_200u]: L0721.4(UB) ; also sheet 8
TRX_RF09_N [diff_50R_200u]: L0721.2(B2) U0701.9(RF09N)
TRX_RF09_P [diff_50R_200u]: L0721.3(B1) U0701.8(RF09P)
TRX_RF24 [uni_50R_200u]: L0722.1(UB) ; also sheet 8
TRX_RF24_N [diff_50R_200u]: L0722.4(B2) U0701.5(RF24N)
TRX_RF24_P [diff_50R_200u]: L0722.3(B1) U0701.4(RF24P)
TRX_RSTN: R0755.2 ; also sheet 2
TRX_RSTN_R: R0755.1 U0701.13(RSTN)
TRX_RXCLK_N [diff_100R_200u]: U0701.33(RXCLKN) ; also sheet 1
TRX_RXCLK_P [diff_100R_200u]: U0701.34(RXCLKP) ; also sheet 1
TRX_RXD09_N [diff_100R_200u]: U0701.30(RXD09N) ; also sheet 1
TRX_RXD09_P [diff_100R_200u]: U0701.31(RXD09P) ; also sheet 1
TRX_RXD24_N [diff_100R_200u]: U0701.35(RXD24N) ; also sheet 1
TRX_RXD24_P [diff_100R_200u]: U0701.36(RXD24P) ; also sheet 1
TRX_SCLK: R0751.2 ; also sheet 2
TRX_SCLK_R: R0751.1 U0701.41(SCLK)
TRX_SELN: R0752.2 ; also sheet 2
TRX_SELN_R: R0752.1 U0701.42(SELN)
TRX_TCXO: C0712.2 U0701.17(TCXO)
TRX_TXCLK_N [diff_100R_200u]: U0701.25(TXCLKN) ; also sheet 1
TRX_TXCLK_P [diff_100R_200u]: U0701.26(TXCLKP) ; also sheet 1
TRX_TXD_N [diff_100R_200u]: U0701.27(TXDN) ; also sheet 1
TRX_TXD_P [diff_100R_200u]: U0701.28(TXDP) ; also sheet 1
VCTCXO_OUT: C0712.1 U0711.3(OUT)
VCTCXO_VC: U0711.1(VC) ; also sheet 6

### Notes on the sheet
- Microchip Technologies AT86RF215
- 26MHz
- TODO:
  - Replace L0701, L0702 by 0 Ohm bridges
  - Replace L0721 by TDK HHM1776B2 (old device loss 22dB)
- SPI: TRX

## Sheet 8 of 15: Front end 868 MHz
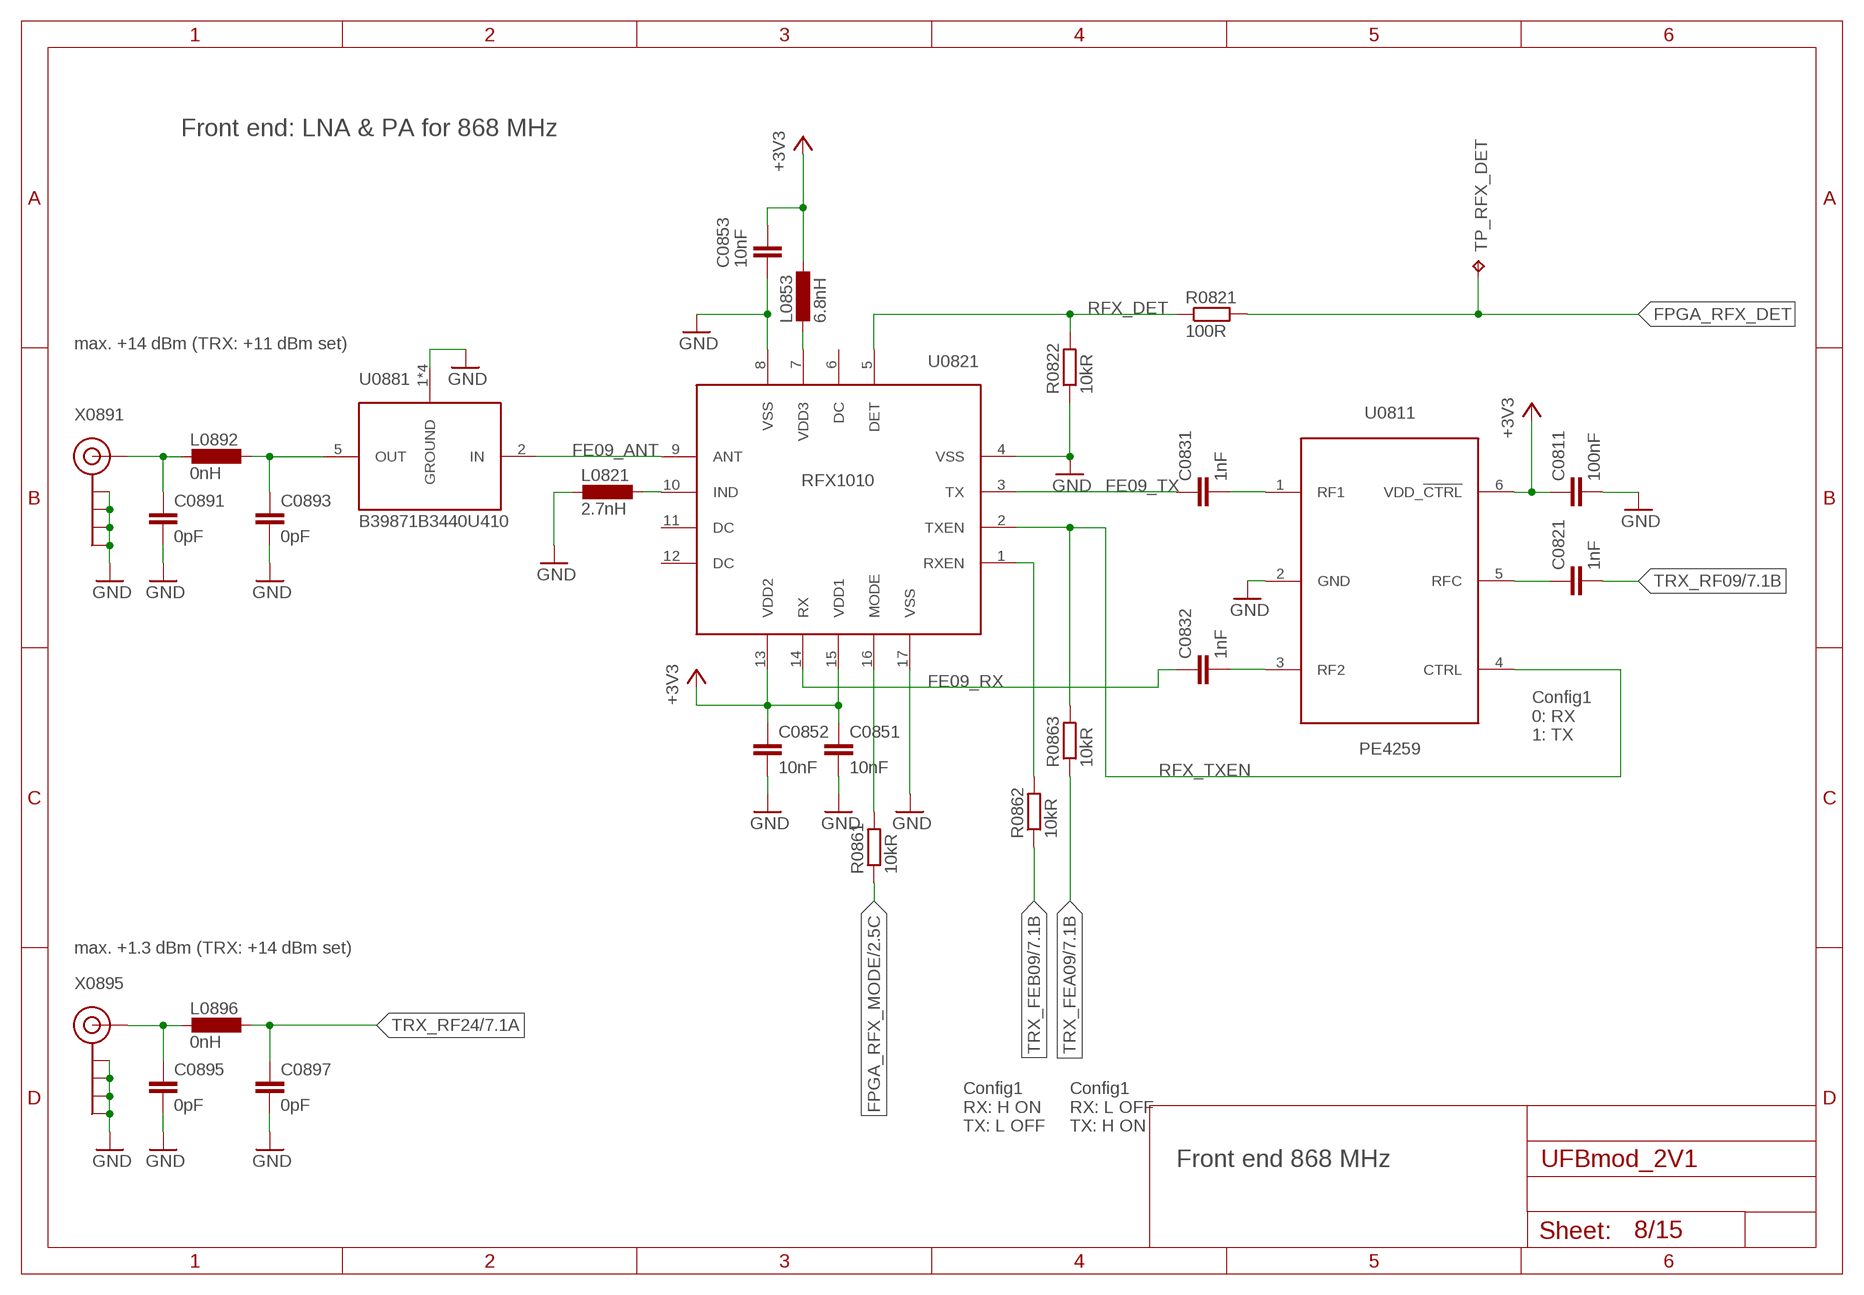
[diagram p7: schematic, sheet 8]

### Parts
C0811  100nF  C-EUC0402  [C0402]
C0821  1nF  C-EUC0402  [C0402]
C0831  1nF  C-EUC0402  [C0402]
C0832  1nF  C-EUC0402  [C0402]
C0851  10nF  C-EUC0402  [C0402]
C0852  10nF  C-EUC0402  [C0402]
C0853  10nF  C-EUC0402  [C0402]
C0891  0pF  C-EUC0402  [C0402]
C0893  0pF  C-EUC0402  [C0402]
C0895  0pF  C-EUC0402  [C0402]
C0897  0pF  C-EUC0402  [C0402]
L0821  2.7nH  L-EUL0603  [L0603]
L0853  6.8nH  L-EUL0603  [L0603]
L0892  0nH  L-EUL0603  [L0603]
L0896  0nH  L-EUL0603  [L0603]
R0821  100R  R-EU_R0402  [R0402]
R0822  10kR  R-EU_R0402  [R0402]
R0861  10kR  R-EU_R0402  [R0402]
R0862  10kR  R-EU_R0402  [R0402]
R0863  10kR  R-EU_R0402  [R0402]
TP_RFX_DET  TPB1,27  [B1,27]
U0811  PE4259  [SC-70_6-LEAD_2X1MM25_0P65]
U0821  RFX1010  [QFN16-3X3-0P5-PAD]
U0881  B39871B3440U410  B3440  [B3440_3MM-X-3MM]
X0891  ANTENNATINY  [SMA_UFL_PAD_TINY]
X0895  ANTENNATINY  [SMA_UFL_PAD_TINY]

### Nets
+3V3: C0811.1 C0851.1 C0852.1 C0853.1 L0853.1 U0811.6(VDD_!CTRL) U0821.13(VDD2) U0821.15(VDD1) ; also sheet 1,2,4,5,6,7,9,11,12,13,14
ANT09 [uni_50R_200u]: C0891.1 L0892.2 X0891.ANT1(SIGNAL) X0891.ANT2(SIGNAL) X0891.ANT3(SIGNAL)
ANT09_MATCH [uni_50R_200u]: C0893.1 L0892.1 U0881.5(OUT)
ANT24 [uni_50R_200u]: C0895.1 L0896.2 X0895.ANT1(SIGNAL) X0895.ANT2(SIGNAL) X0895.ANT3(SIGNAL)
FE09_ANT [uni_50R_200u]: U0821.9(ANT) U0881.2(IN)
FE09_RX [uni_50R_200u]: C0832.1 U0821.14(RX)
FE09_TX [uni_50R_200u]: C0831.1 U0821.3(TX)
FPGA_RFX_DET: R0821.2 TP_RFX_DET.TP
FPGA_RFX_MODE: R0861.1 ; also sheet 2
GND: C0811.2 C0851.2 C0852.2 C0853.2 C0891.2 C0893.2 C0895.2 C0897.2 L0821.2 R0822.1 U0811.2(GND) U0821.4(VSS) U0821.8(VSS) U0821.17(VSS) U0881.1(GROUND) U0881.3(GROUND) U0881.4(GROUND) U0881.6(GROUND) X0891.GND1(GND) X0891.GND2(GND) X0891.GND3(GND) X0891.GND4(GND) X0895.GND1(GND) X0895.GND2(GND) X0895.GND3(GND) X0895.GND4(GND) ; also sheet 1,2,3,5,6,7,9,10,11,12,13,14,15
PE09_RF1 [uni_50R_200u]: C0831.2 U0811.1(RF1)
PE09_RF2 [uni_50R_200u]: C0832.2 U0811.3(RF2)
PE09_RFC [uni_50R_200u]: C0821.1 U0811.5(RFC)
RFX_DET: R0821.1 R0822.2 U0821.5(DET)
RFX_IND: L0821.1 U0821.10(IND)
RFX_MODE: R0861.2 U0821.16(MODE)
RFX_RXEN: R0862.2 U0821.1(RXEN)
RFX_TXEN: R0863.2 U0811.4(CTRL) U0821.2(TXEN)
RFX_VDD3: L0853.2 U0821.7(VDD3)
TRX_FEA09: R0863.1 ; also sheet 7
TRX_FEB09: R0862.1 ; also sheet 7
TRX_RF09 [uni_50R_200u]: C0821.2 ; also sheet 7
TRX_RF24 [uni_50R_200u]: C0897.1 L0896.1 ; also sheet 7
Unconnected: U0821.6(DC) U0821.11(DC) U0821.12(DC)

### Notes on the sheet
- Front end: LNA & PA for 868 MHz
- max. +14 dBm (TRX: +11 dBm set)
- X0891
- Config1
  0: RX
  1: TX
- max. +1.3 dBm (TRX: +14 dBm set)
- X0895
- Config1
  RX: H ON
  TX: L OFF
- Config1
  RX: L OFF
  TX: H ON
- Front end 868 MHz

## Sheet 9 of 15: USB / UART
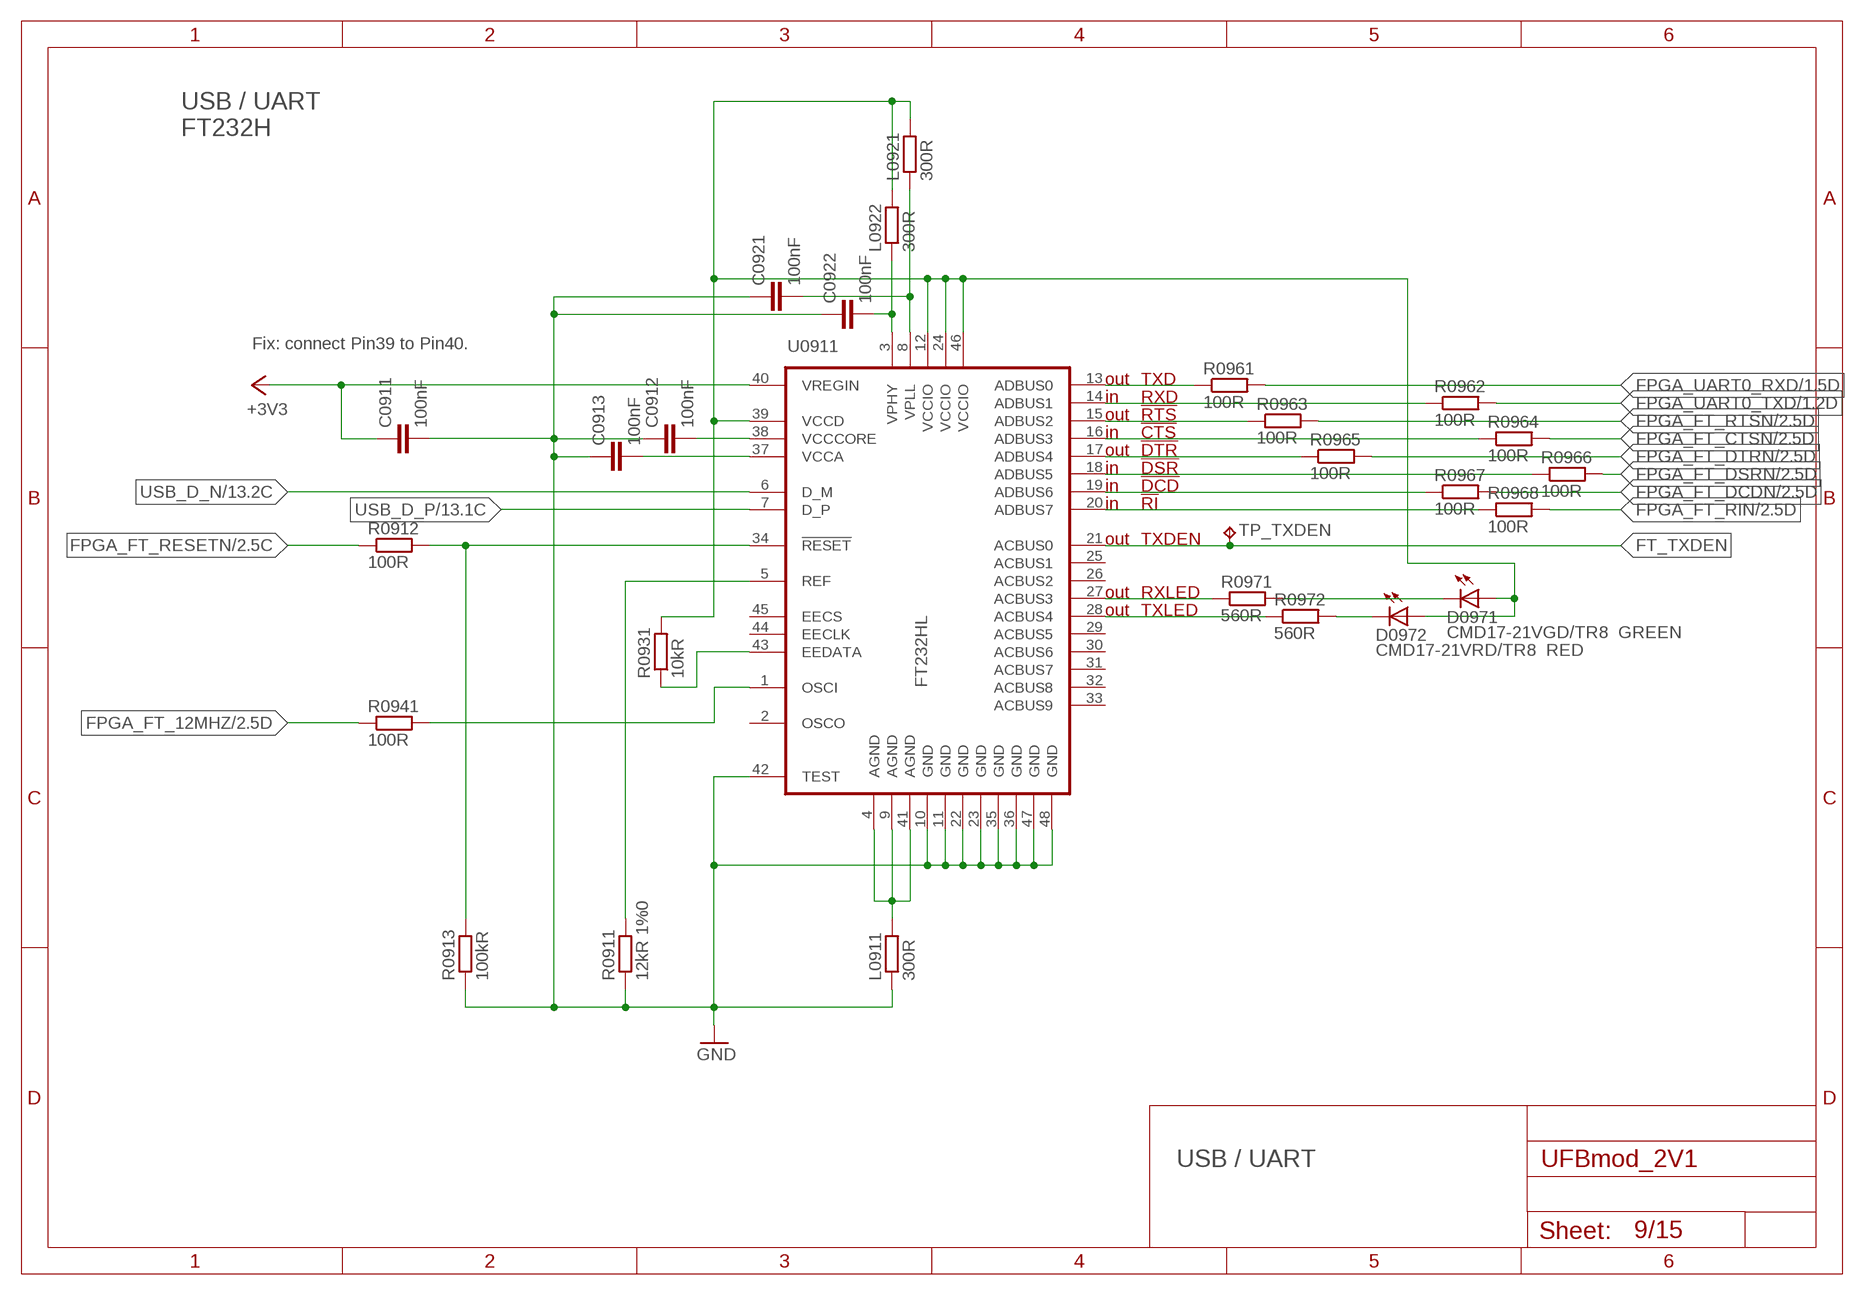
[diagram p8: schematic, sheet 9]

### Parts
C0911  100nF  C-EUC0402  [C0402]
C0912  100nF  C-EUC0402  [C0402]
C0913  100nF  C-EUC0402  [C0402]
C0921  100nF  C-EUC0402  [C0402]
C0922  100nF  C-EUC0402  [C0402]
D0971  CMD17-21VGD/TR8 GREEN  LEDCHIP-LED0805  [CHIP-LED0805]
D0972  CMD17-21VRD/TR8 RED  LEDCHIP-LED0805  [CHIP-LED0805]
L0911  300R  R-EU_R1206  [R1206]
L0921  300R  R-EU_R1206  [R1206]
L0922  300R  R-EU_R1206  [R1206]
R0911  12kR 1%0  R-EU_R0402  [R0402]
R0912  100R  R-EU_R0402  [R0402]
R0913  100kR  R-EU_R0402  [R0402]
R0931  10kR  R-EU_R0402  [R0402]
R0941  100R  R-EU_R0402  [R0402]
R0961  100R  R-EU_R0402  [R0402]
R0962  100R  R-EU_R0402  [R0402]
R0963  100R  R-EU_R0402  [R0402]
R0964  100R  R-EU_R0402  [R0402]
R0965  100R  R-EU_R0402  [R0402]
R0966  100R  R-EU_R0402  [R0402]
R0967  100R  R-EU_R0402  [R0402]
R0968  100R  R-EU_R0402  [R0402]
R0971  560R  R-EU_R0402  [R0402]
R0972  560R  R-EU_R0402  [R0402]
TP_TXDEN  TPB1,27  [B1,27]
U0911  FT232HL  FTDI232HL  [LQFP48]

### Nets
+3V3: C0911.1 U0911.40(VREGIN) ; also sheet 1,2,4,5,6,7,8,11,12,13,14
FPGA_FT_12MHZ: R0941.1 ; also sheet 2
FPGA_FT_CTSN: R0964.2 ; also sheet 2
FPGA_FT_DCDN: R0967.2 ; also sheet 2
FPGA_FT_DSRN: R0966.2 ; also sheet 2
FPGA_FT_DTRN: R0965.2 ; also sheet 2
FPGA_FT_RESETN: R0912.1 ; also sheet 2
FPGA_FT_RIN: R0968.2 ; also sheet 2
FPGA_FT_RTSN: R0963.2 ; also sheet 2
FPGA_UART0_RXD: R0961.2 ; also sheet 1
FPGA_UART0_TXD: R0962.2 ; also sheet 1
FT_AGND: L0911.2 U0911.4(AGND) U0911.9(AGND) U0911.41(AGND)
FT_CTS: R0964.1 U0911.16(ADBUS3)
FT_DCD: R0967.1 U0911.19(ADBUS6)
FT_DSR: R0966.1 U0911.18(ADBUS5)
FT_DTR: R0965.1 U0911.17(ADBUS4)
FT_EEDATA: R0931.1 U0911.43(EEDATA)
FT_OSCI: R0941.2 U0911.1(OSCI)
FT_REF: R0911.2 U0911.5(REF)
FT_RESET: R0912.2 R0913.2 U0911.34(!RESET)
FT_RI: R0968.1 U0911.20(ADBUS7)
FT_RTS: R0963.1 U0911.15(ADBUS2)
FT_RXD: R0962.1 U0911.14(ADBUS1)
FT_RXLED: R0971.1 U0911.27(ACBUS3)
FT_RXLED_D: D0971.C R0971.2
FT_TXD: R0961.1 U0911.13(ADBUS0)
FT_TXDEN: TP_TXDEN.TP U0911.21(ACBUS0)
FT_TXLED: R0972.1 U0911.28(ACBUS4)
FT_TXLED_D: D0972.C R0972.2
FT_VCCA: C0913.2 U0911.37(VCCA)
FT_VCCCORE: C0912.2 U0911.38(VCCCORE)
FT_VCCD: D0971.A D0972.A L0921.2 L0922.2 R0931.2 U0911.12(VCCIO) U0911.24(VCCIO) U0911.39(VCCD) U0911.46(VCCIO)
FT_VPHY: C0922.2 L0922.1 U0911.3(VPHY)
FT_VPLL: C0921.2 L0921.1 U0911.8(VPLL)
GND: C0911.2 C0912.1 C0913.1 C0921.1 C0922.1 L0911.1 R0911.1 R0913.1 U0911.10(GND) U0911.11(GND) U0911.22(GND) U0911.23(GND) U0911.35(GND) U0911.36(GND) U0911.42(TEST) U0911.47(GND) U0911.48(GND) ; also sheet 1,2,3,5,6,7,8,10,11,12,13,14,15
USB_D_N [diff_90R_200u]: U0911.6(D_M) ; also sheet 13
USB_D_P [diff_90R_200u]: U0911.7(D_P) ; also sheet 13
Unconnected: U0911.2(OSCO) U0911.25(ACBUS1) U0911.26(ACBUS2) U0911.29(ACBUS5) U0911.30(ACBUS6) U0911.31(ACBUS7) U0911.32(ACBUS8) U0911.33(ACBUS9) U0911.44(EECLK) U0911.45(EECS)

### Notes on the sheet
- USB / UART
  FT232H
- Fix: connect Pin39 to Pin40.
- out
- in
- out
- in
- out
- in
- in
- in
- out
- out
- out
- USB / UART

## Sheet 10 of 15: Rotary - LEDs
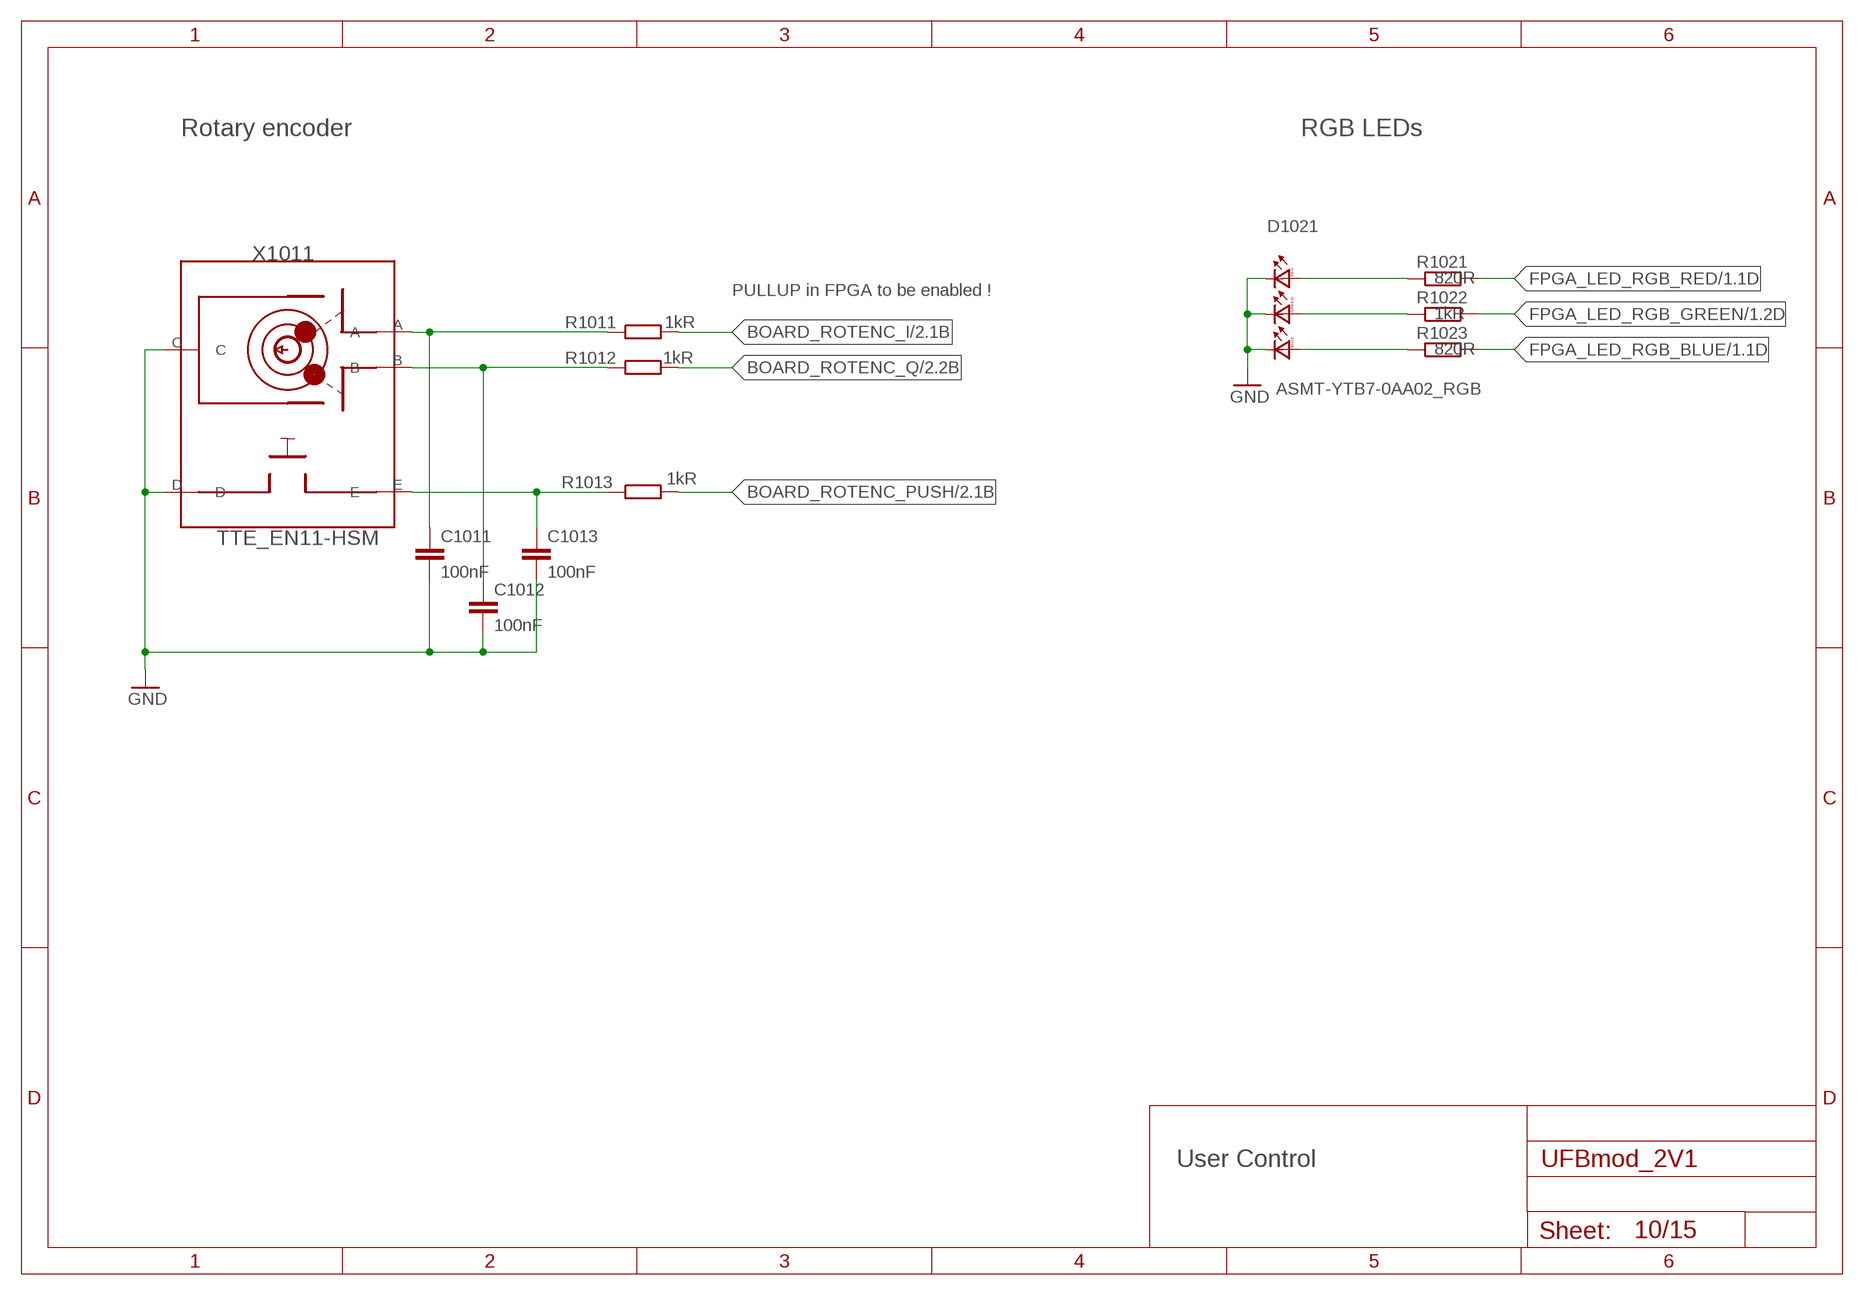
[diagram p9: schematic, sheet 10]

### Parts
C1011  100nF  C-EUC0402  [C0402]
C1012  100nF  C-EUC0402  [C0402]
C1013  100nF  C-EUC0402  [C0402]
D1021  ASMT-YTB7-0AA02_RGB  [ASMT-YTB7_0AA02_RGB]
R1011  1kR  R-EU_R0402  [R0402]
R1012  1kR  R-EU_R0402  [R0402]
R1013  1kR  R-EU_R0402  [R0402]
R1021  820R  R-EU_R0402  [R0402]
R1022  1kR  R-EU_R0402  [R0402]
R1023  820R  R-EU_R0402  [R0402]
X1011  TTE_EN11-HSM  [TTE_EN11-HSM]

### Nets
BOARD_ROTENC_I: R1011.2 ; also sheet 2
BOARD_ROTENC_PUSH: R1013.2 ; also sheet 2
BOARD_ROTENC_Q: R1012.2 ; also sheet 2
FPGA_LED_RGB_BLUE: R1023.2 ; also sheet 1
FPGA_LED_RGB_GREEN: R1022.2 ; also sheet 1
FPGA_LED_RGB_RED: R1021.2 ; also sheet 1
GND: C1011.2 C1012.2 C1013.2 D1021.1(BC) D1021.2(GC) D1021.3(RC) X1011.C X1011.D ; also sheet 1,2,3,5,6,7,8,9,11,12,13,14,15
LED_RGB_BLUE: D1021.6(BA) R1023.1
LED_RGB_GREEN: D1021.5(GA) R1022.1
LED_RGB_RED: D1021.4(RA) R1021.1
ROT_I: C1011.1 R1011.1 X1011.A
ROT_P: C1013.1 R1013.1 X1011.E
ROT_Q: C1012.1 R1012.1 X1011.B

### Notes on the sheet
- Rotary encoder | RGB LEDs
- PULLUP in FPGA to be enabled !
- User Control

## Sheet 11 of 15: PMIC 5V..14V --> 3.3V_REG
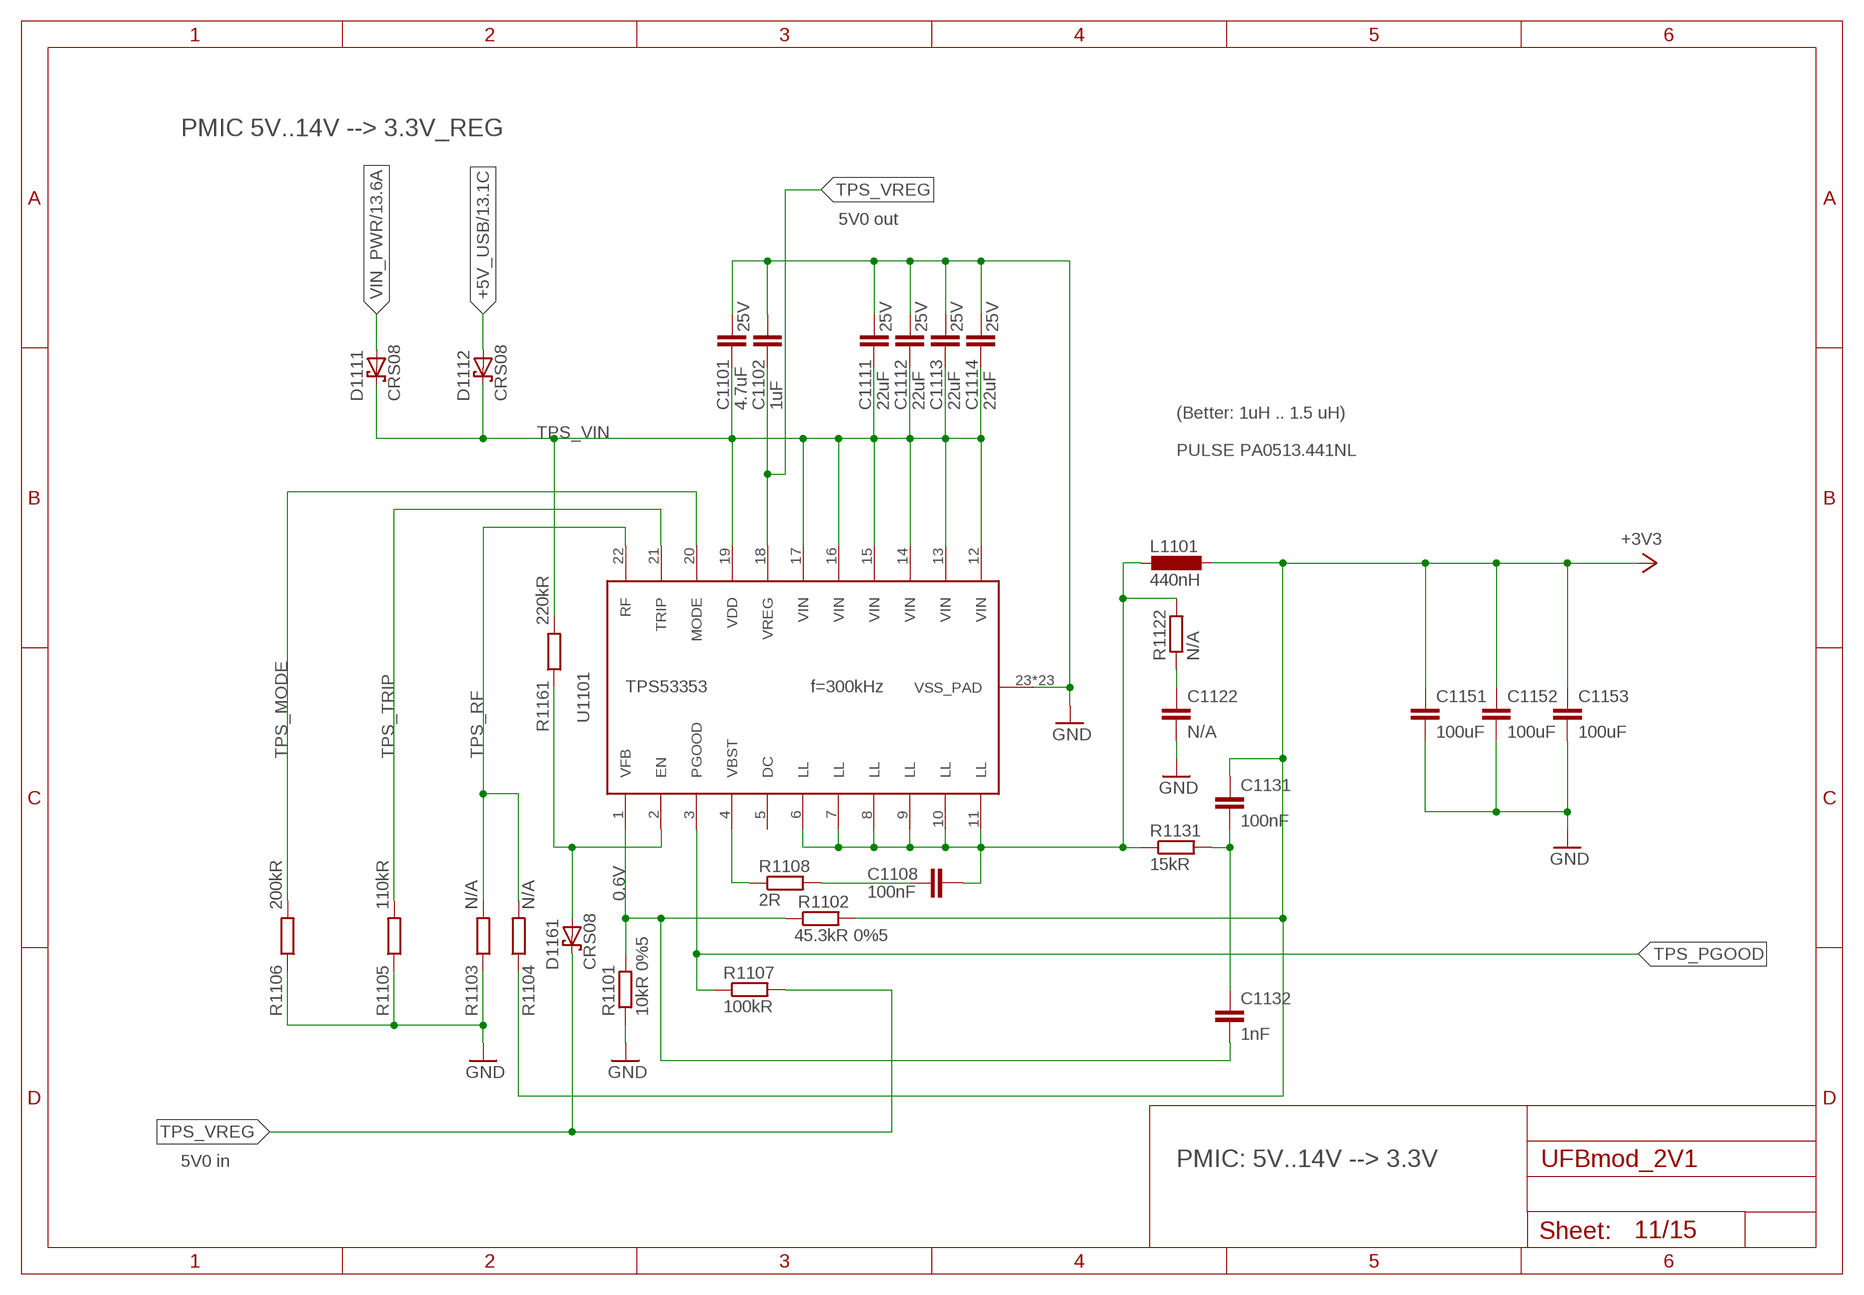
[diagram p10: schematic, sheet 11]

### Parts
C1101  4.7uF  C-EUC0805  [C0805]
C1102  1uF  C-EUC0402  [C0402]
C1108  100nF  C-EUC0805  [C0805]
C1111  22uF  C-EUC0805  [C0805]
C1112  22uF  C-EUC0805  [C0805]
C1113  22uF  C-EUC0805  [C0805]
C1114  22uF  C-EUC0805  [C0805]
C1122  N/A  C-EUC0805  [C0805]  (not fitted in variant Std)
C1131  100nF  C-EUC0402  [C0402]
C1132  1nF  C-EUC0402  [C0402]
C1151  100uF  C-EUC0805  [C0805]
C1152  100uF  C-EUC0805  [C0805]
C1153  100uF  C-EUC0805  [C0805]
D1111  CRS08  [SOD80C]
D1112  CRS08  [SOD80C]
D1161  CRS08  [SOD80C]
L1101  440nH  L-EUL1812  [L1812]
R1101  10kR 0%5  R-EU_R0402  [R0402]
R1102  45.3kR 0%5  R-EU_R0402  [R0402]
R1103  N/A  R-EU_R0402  [R0402]
R1104  N/A  R-EU_R0402  [R0402]  (not fitted in variant Std)
R1105  110kR  R-EU_R0402  [R0402]
R1106  200kR  R-EU_R0402  [R0402]
R1107  100kR  R-EU_R0402  [R0402]
R1108  2R  R-EU_R0805  [R0805]
R1122  N/A  R-EU_R0805  [R0805]  (not fitted in variant Std)
R1131  15kR  R-EU_R0402  [R0402]
R1161  220kR  R-EU_R0402  [R0402]
U1101  TPS53353  [DQP-22]

### Nets
+3V3: C1131.1 C1151.1 C1152.1 C1153.1 L1101.1 R1102.2 R1104.1 ; also sheet 1,2,4,5,6,7,8,9,12,13,14
+5V_USB: D1112.A ; also sheet 13
GND: C1101.1 C1102.1 C1111.1 C1112.1 C1113.1 C1114.1 C1122.2 C1151.2 C1152.2 C1153.2 R1101.1 R1103.1 R1105.1 R1106.1 U1101.23(VSS_PAD) U1101.24(VSS_PAD) U1101.P$1(VSS_PAD) U1101.P$2(VSS_PAD) U1101.P$3(VSS_PAD) U1101.P$4(VSS_PAD) U1101.P$5(VSS_PAD) U1101.P$6(VSS_PAD) U1101.P$7(VSS_PAD) U1101.P$8(VSS_PAD) U1101.P$9(VSS_PAD) U1101.P$10(VSS_PAD) U1101.P$11(VSS_PAD) U1101.P$12(VSS_PAD) U1101.P$13(VSS_PAD) U1101.P$14(VSS_PAD) U1101.P$15(VSS_PAD) U1101.P$16(VSS_PAD) U1101.P$17(VSS_PAD) U1101.P$18(VSS_PAD) U1101.P$19(VSS_PAD) U1101.P$20(VSS_PAD) U1101.P$21(VSS_PAD) ; also sheet 1,2,3,5,6,7,8,9,10,12,13,14,15
TPS_COR: C1131.2 C1132.1 R1131.2
TPS_EN: D1161.A R1161.1 U1101.2(EN)
TPS_LL: C1108.1 L1101.2 R1122.2 R1131.1 U1101.6(LL) U1101.7(LL) U1101.8(LL) U1101.9(LL) U1101.10(LL) U1101.11(LL)
TPS_LL_RC: C1122.1 R1122.1
TPS_MODE: R1106.2 U1101.20(MODE)
TPS_PGOOD: R1107.1 U1101.3(PGOOD)
TPS_RF: R1103.2 R1104.2 U1101.22(RF)
TPS_TRIP: R1105.2 U1101.21(TRIP)
TPS_VBST: R1108.1 U1101.4(VBST)
TPS_VBST_R: C1108.2 R1108.2
TPS_VFB: C1132.2 R1101.2 R1102.1 U1101.1(VFB)
TPS_VIN: C1101.2 C1111.2 C1112.2 C1113.2 C1114.2 D1111.C D1112.C R1161.2 U1101.12(VIN) U1101.13(VIN) U1101.14(VIN) U1101.15(VIN) U1101.16(VIN) U1101.17(VIN) U1101.19(VDD)
TPS_VREG: C1102.2 D1161.C R1107.2 U1101.18(VREG)
VIN_PWR: D1111.A ; also sheet 13
Unconnected: U1101.5(DC)

### Notes on the sheet
- PMIC 5V..14V --> 3.3V_REG
- 5V0 out
- 25V | 25V | 25V | 25V | 25V
- (Better: 1uH .. 1.5 uH)
- PULSE PA0513.441NL
- f=300kHz
- 0.6V
- 5V0 in | PMIC: 5V..14V --> 3.3V

## Sheet 12 of 15: PMIC 3.5V --> 2.5V
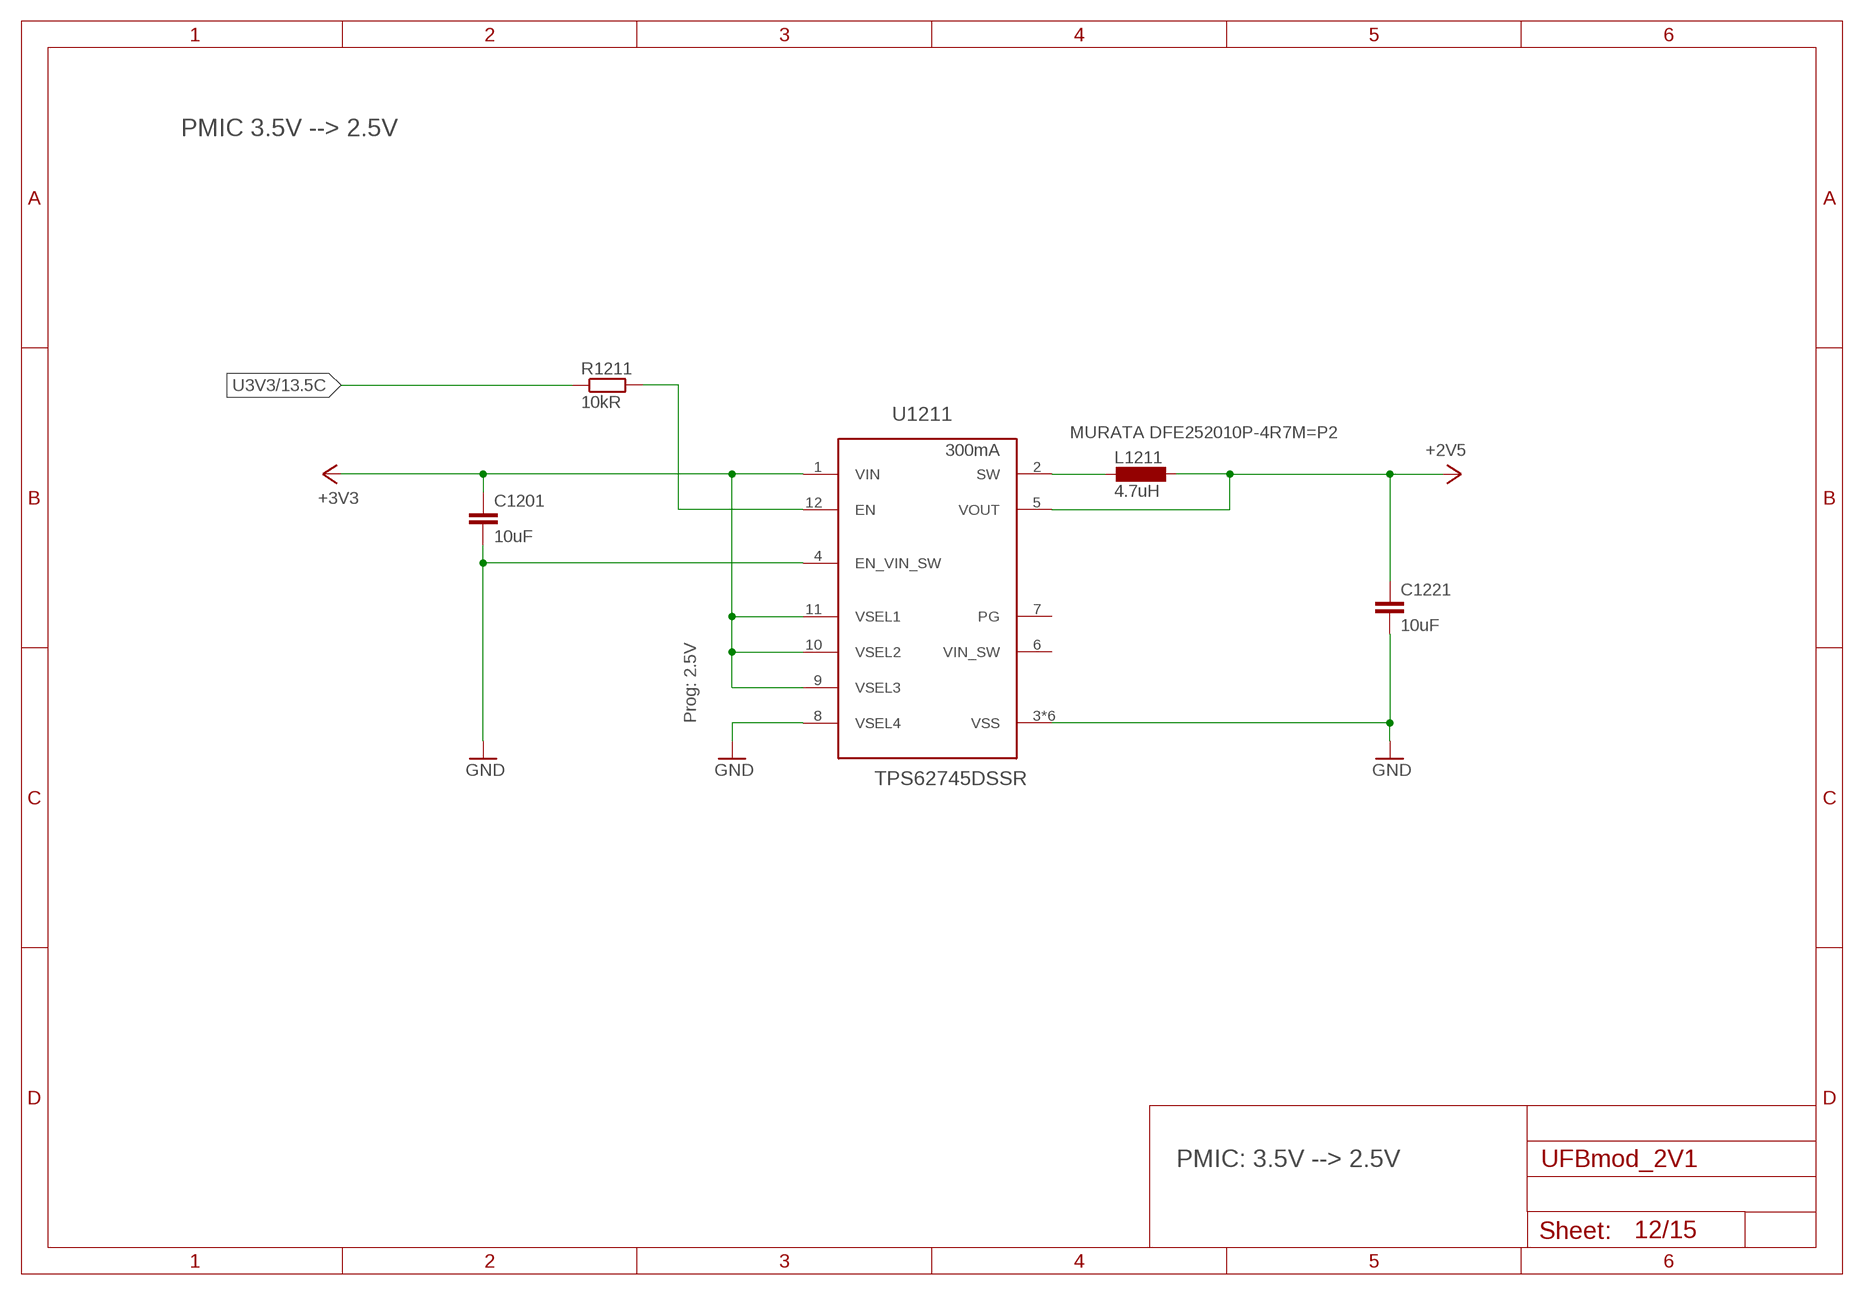
[diagram p11: schematic, sheet 12]

### Parts
C1201  10uF  C-EUC0603  [C0603]
C1221  10uF  C-EUC0603  [C0603]
L1211  4.7uH  L-EUL2520  [L2520]
R1211  10kR  R-EU_R0402  [R0402]
U1211  TPS62745DSSR  TPS62745  [WSON-12]

### Nets
+2V5: C1221.1 L1211.1 U1211.5(VOUT) ; also sheet 2,13
+3V3: C1201.1 U1211.1(VIN) U1211.9(VSEL3) U1211.10(VSEL2) U1211.11(VSEL1) ; also sheet 1,2,4,5,6,7,8,9,11,13,14
GND: C1201.2 C1221.2 U1211.3(VSS) U1211.4(EN_VIN_SW) U1211.8(VSEL4) U1211.13(VSS) U1211.14(VSS) U1211.G1(VSS) U1211.G2(VSS) U1211.G3(VSS) ; also sheet 1,2,3,5,6,7,8,9,10,11,13,14,15
PMIC3V3_SW: L1211.2 U1211.2(SW)
TPS2_EN: R1211.2 U1211.12(EN)
U3V3: R1211.1 ; also sheet 1,2,13
Unconnected: U1211.6(VIN_SW) U1211.7(PG)

### Notes on the sheet
- PMIC 3.5V --> 2.5V
- MURATA DFE252010P-4R7M=P2
- 300mA
- Prog: 2.5V
- PMIC: 3.5V --> 2.5V

## Sheet 13 of 15: Connectors 1
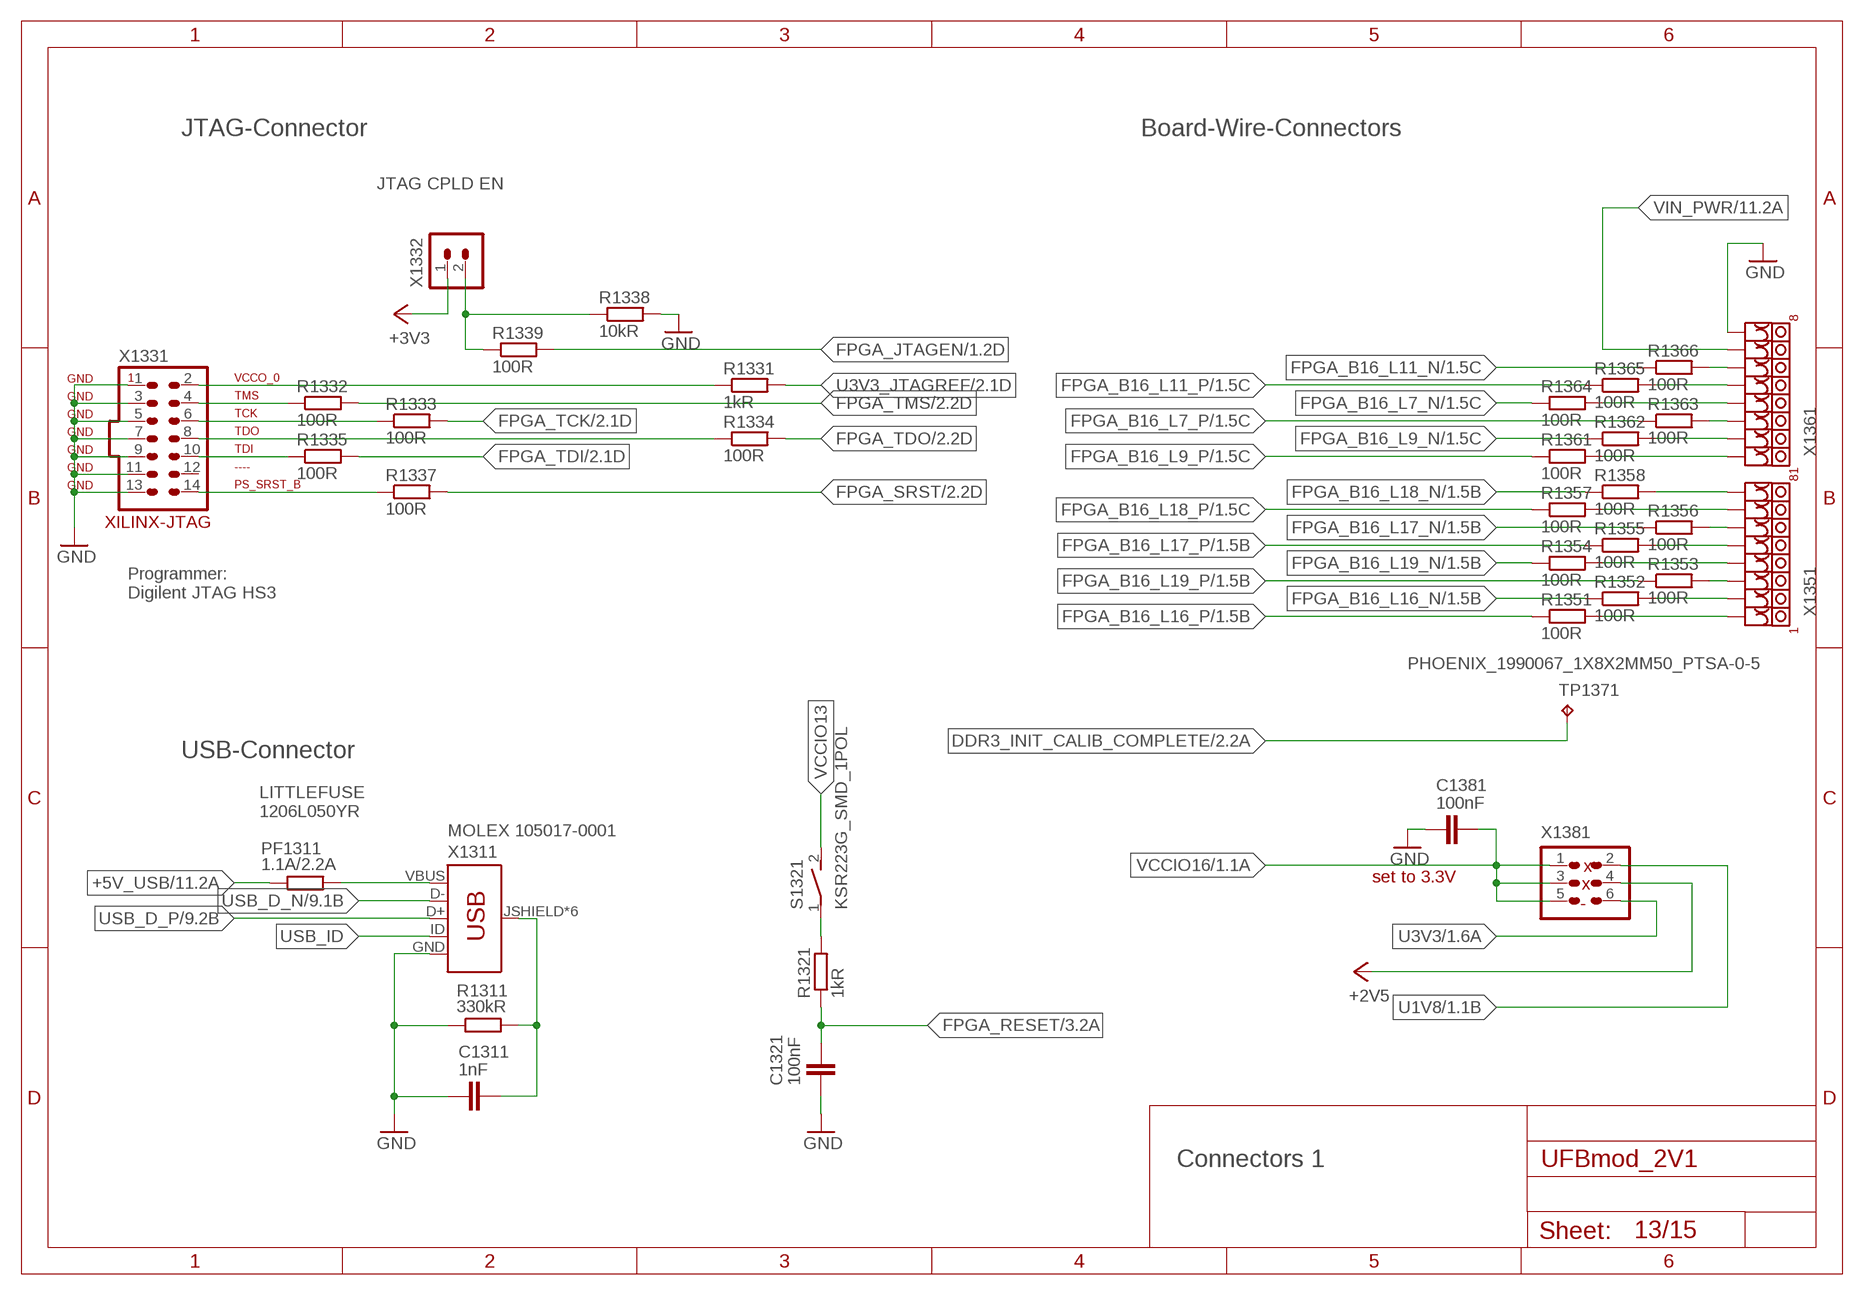
[diagram p12: schematic, sheet 13]

### Parts
C1311  1nF  C-EUC0402  [C0402]
C1321  100nF  C-EUC0402  [C0402]
C1381  100nF  C-EUC0402  [C0402]
PF1311  1.1A/2.2A  R-EU_M1206  [M1206]
R1311  330kR  R-EU_R0402  [R0402]
R1321  1kR  R-EU_R0402  [R0402]
R1331  1kR  R-EU_R0402  [R0402]
R1332  100R  R-EU_R0402  [R0402]
R1333  100R  R-EU_R0402  [R0402]
R1334  100R  R-EU_R0402  [R0402]
R1335  100R  R-EU_R0402  [R0402]
R1337  100R  R-EU_R0402  [R0402]
R1338  10kR  R-EU_R0402  [R0402]
R1339  100R  R-EU_R0402  [R0402]
R1351  100R  R-EU_R0402  [R0402]
R1352  100R  R-EU_R0402  [R0402]
R1353  100R  R-EU_R0402  [R0402]
R1354  100R  R-EU_R0402  [R0402]
R1355  100R  R-EU_R0402  [R0402]
R1356  100R  R-EU_R0402  [R0402]
R1357  100R  R-EU_R0402  [R0402]
R1358  100R  R-EU_R0402  [R0402]
R1361  100R  R-EU_R0402  [R0402]
R1362  100R  R-EU_R0402  [R0402]
R1363  100R  R-EU_R0402  [R0402]
R1364  100R  R-EU_R0402  [R0402]
R1365  100R  R-EU_R0402  [R0402]
R1366  100R  R-EU_R0402  [R0402]
S1321  KSR223G_SMD_1POL  [KSR223G_SMD_1POL]
TP1371  TPB1,27  [B1,27]
X1311  MOLEX 105017-0001  USB_MICRO-B_MOLEX  [USB-B-MICRO-SMD_MOLEX-105017-0001]
X1331  XILINX-JTAG-14  [2X07_2MM00_SHROUDED_XILINX_JTAG]
X1332  HEADER-1X2  [1X02]
X1351  PHOENIX_1990067_1X8X2MM50_PTSA-0-5  [PHOENIX_1990067_1X8X2MM50_PTSA-0-5]
X1361  PHOENIX_1990067_1X8X2MM50_PTSA-0-5  [PHOENIX_1990067_1X8X2MM50_PTSA-0-5]
X1381  HEADER-2X3  [2X03]

### Nets
+2V5: X1381.4 ; also sheet 2,12
+3V3: X1332.1 ; also sheet 1,2,4,5,6,7,8,9,11,12,14
+5V_USB: PF1311.1 ; also sheet 11
B2W_51: R1351.2 X1351.1
B2W_52: R1352.2 X1351.2
B2W_53: R1353.2 X1351.3
B2W_54: R1354.2 X1351.4
B2W_55: R1355.2 X1351.5
B2W_56: R1356.2 X1351.6
B2W_57: R1357.2 X1351.7
B2W_58: R1358.2 X1351.8
B2W_61: R1361.2 X1361.1
B2W_62: R1362.2 X1361.2
B2W_63: R1363.2 X1361.3
B2W_64: R1364.2 X1361.4
B2W_65: R1365.2 X1361.5
B2W_66: R1366.2 X1361.6
DDR3_INIT_CALIB_COMPLETE: TP1371.TP ; also sheet 2
FPGA_B16_L7_N [diff_100R_360u]: R1364.1 ; also sheet 1
FPGA_B16_L7_P [diff_100R_360u]: R1363.1 ; also sheet 1
FPGA_B16_L9_N: R1362.1 ; also sheet 1
FPGA_B16_L9_P [diff_100R_360u]: R1361.1 ; also sheet 1
FPGA_B16_L11_N [diff_100R_360u]: R1366.1 ; also sheet 1
FPGA_B16_L11_P [diff_100R_360u]: R1365.1 ; also sheet 1
FPGA_B16_L16_N [diff_100R_360u]: R1352.1 ; also sheet 1
FPGA_B16_L16_P [diff_100R_360u]: R1351.1 ; also sheet 1
FPGA_B16_L17_N [diff_100R_360u]: R1356.1 ; also sheet 1
FPGA_B16_L17_P [diff_100R_360u]: R1355.1 ; also sheet 1
FPGA_B16_L18_N [diff_100R_360u]: R1358.1 ; also sheet 1
FPGA_B16_L18_P [diff_100R_360u]: R1357.1 ; also sheet 1
FPGA_B16_L19_N [diff_100R_360u]: R1354.1 ; also sheet 1
FPGA_B16_L19_P [diff_100R_360u]: R1353.1 ; also sheet 1
FPGA_JTAGEN: R1339.2 ; also sheet 1
FPGA_RESET: C1321.2 R1321.1 ; also sheet 3
FPGA_RESET_R: R1321.2 S1321.1(P)
FPGA_SRST: R1337.2 ; also sheet 2
FPGA_TCK: R1333.2 ; also sheet 2
FPGA_TDI: R1335.2 ; also sheet 2
FPGA_TDO: R1334.2 ; also sheet 2
FPGA_TMS: R1332.2 ; also sheet 2
GND: C1311.1 C1321.1 C1381.1 R1311.1 R1338.2 X1311.GND X1331.1 X1331.3 X1331.5 X1331.7 X1331.9 X1331.11 X1331.13 X1361.8 ; also sheet 1,2,3,5,6,7,8,9,10,11,12,14,15
JC_SRST: R1337.1 X1331.14
JC_TCK: R1333.1 X1331.6
JC_TDI: R1335.1 X1331.10
JC_TDO: R1334.1 X1331.8
JC_TMS: R1332.1 X1331.4
JC_VCCO_0: R1331.1 X1331.2
JTAG_CPLD_EN: R1338.1 R1339.1 X1332.2
U1V8: X1381.2 ; also sheet 1,2
U3V3: X1381.6 ; also sheet 1,2,12
U3V3_JTAGREF: R1331.2 ; also sheet 2
USB_D_N [diff_90R_200u]: X1311.D-(J_D-) ; also sheet 9
USB_D_P [diff_90R_200u]: X1311.D+(J_D+) ; also sheet 9
USB_ID: X1311.ID(J_ID)
USB_SHIELD: C1311.2 R1311.2 X1311.JSHIELD(SHIELD) X1311.JSHIELD@2(SHIELD) X1311.JSHIELD@3(SHIELD) X1311.JSHIELD@4(SHIELD) X1311.JSHIELD@5(SHIELD) X1311.JSHIELD@6(SHIELD)
USB_VBUS: PF1311.2 X1311.VBUS(J_VUSB)
VCCIO13: S1321.2(S) ; also sheet 2
VCCIO16: C1381.2 X1381.1 X1381.3 X1381.5 ; also sheet 1
VIN_PWR: X1361.7 ; also sheet 11
Unconnected: X1331.12

### Notes on the sheet
- JTAG-Connector | Board-Wire-Connectors
- JTAG CPLD EN
- Programmer:
  Digilent JTAG HS3
- USB-Connector
- LITTLEFUSE
  1206L050YR
- x
- set to 3.3V
- x
- -
- Connectors 1

## Sheet 14 of 15: Connectors 2
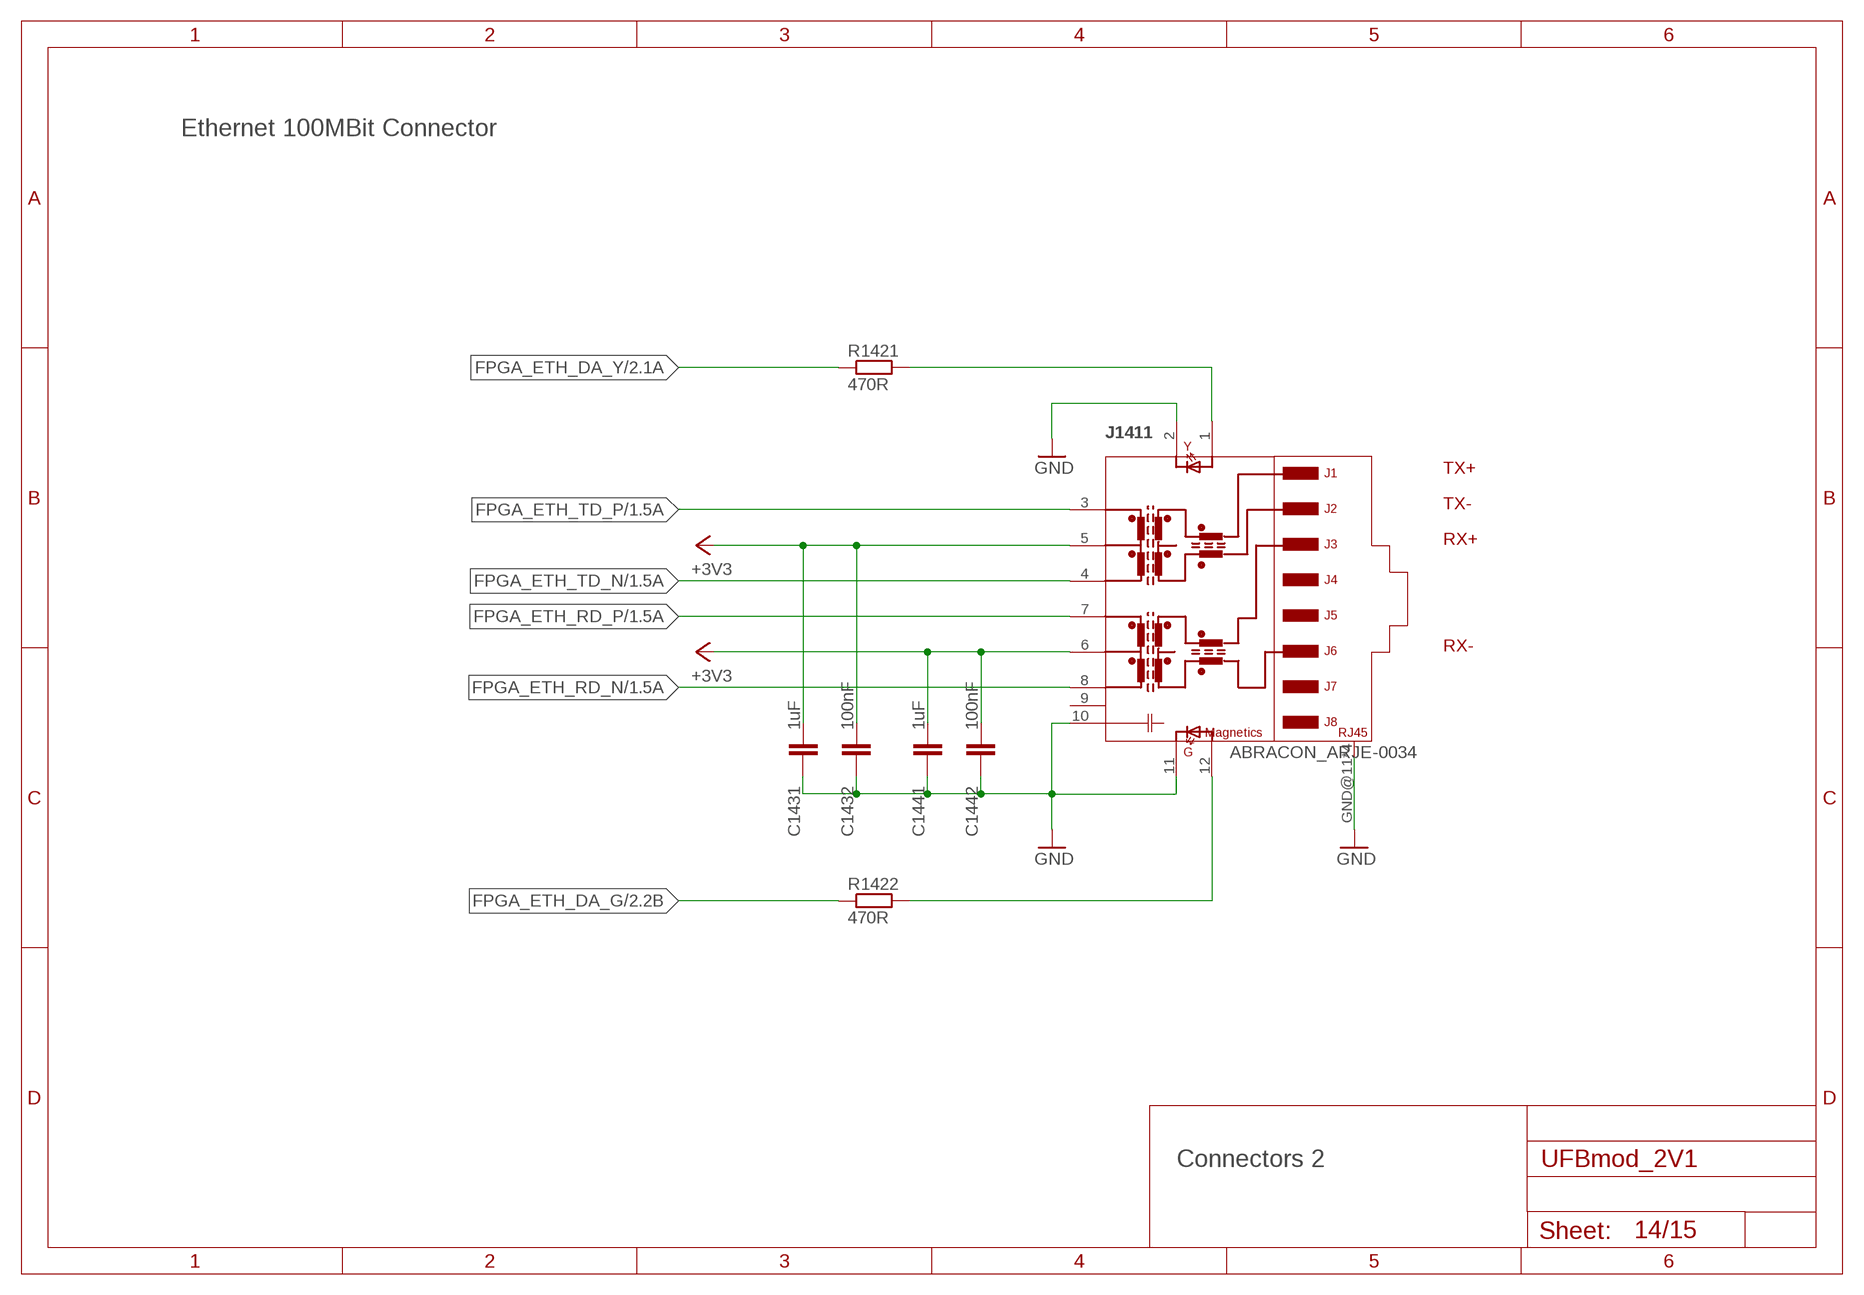
[diagram p13: schematic, sheet 14]

### Parts
C1431  1uF  C-EUC0402  [C0402]
C1432  100nF  C-EUC0402  [C0402]
C1441  1uF  C-EUC0402  [C0402]
C1442  100nF  C-EUC0402  [C0402]
J1411  ABRACON_ARJE-0034  ARJE-0034_RJ45_WITH_MAGNETICS  [ARJE-0034_RJ45_WITH_MAGNETICS]
R1421  470R  R-EU_R0402  [R0402]
R1422  470R  R-EU_R0402  [R0402]

### Nets
+3V3: C1431.1 C1432.1 C1441.1 C1442.1 J1411.5 J1411.6 ; also sheet 1,2,4,5,6,7,8,9,11,12,13
ETH_DA_G: J1411.12 R1422.2
ETH_DA_Y: J1411.1 R1421.2
FPGA_ETH_DA_G: R1422.1 ; also sheet 2
FPGA_ETH_DA_Y: R1421.1 ; also sheet 2
FPGA_ETH_RD_N [diff_100R_200u]: J1411.8 ; also sheet 1
FPGA_ETH_RD_P [diff_100R_200u]: J1411.7 ; also sheet 1
FPGA_ETH_TD_N [diff_100R_200u]: J1411.4 ; also sheet 1
FPGA_ETH_TD_P [diff_100R_200u]: J1411.3 ; also sheet 1
GND: C1431.2 C1432.2 C1441.2 C1442.2 J1411.2 J1411.10 J1411.11 J1411.GND@11 J1411.GND@12 J1411.GND@21 J1411.GND@22 ; also sheet 1,2,3,5,6,7,8,9,10,11,12,13,15
Unconnected: J1411.9

### Notes on the sheet
- Ethernet 100MBit Connector
- TX+
- TX-
- RX+
- RX-
- Connectors 2

## Sheet 15 of 15: Mounting holes
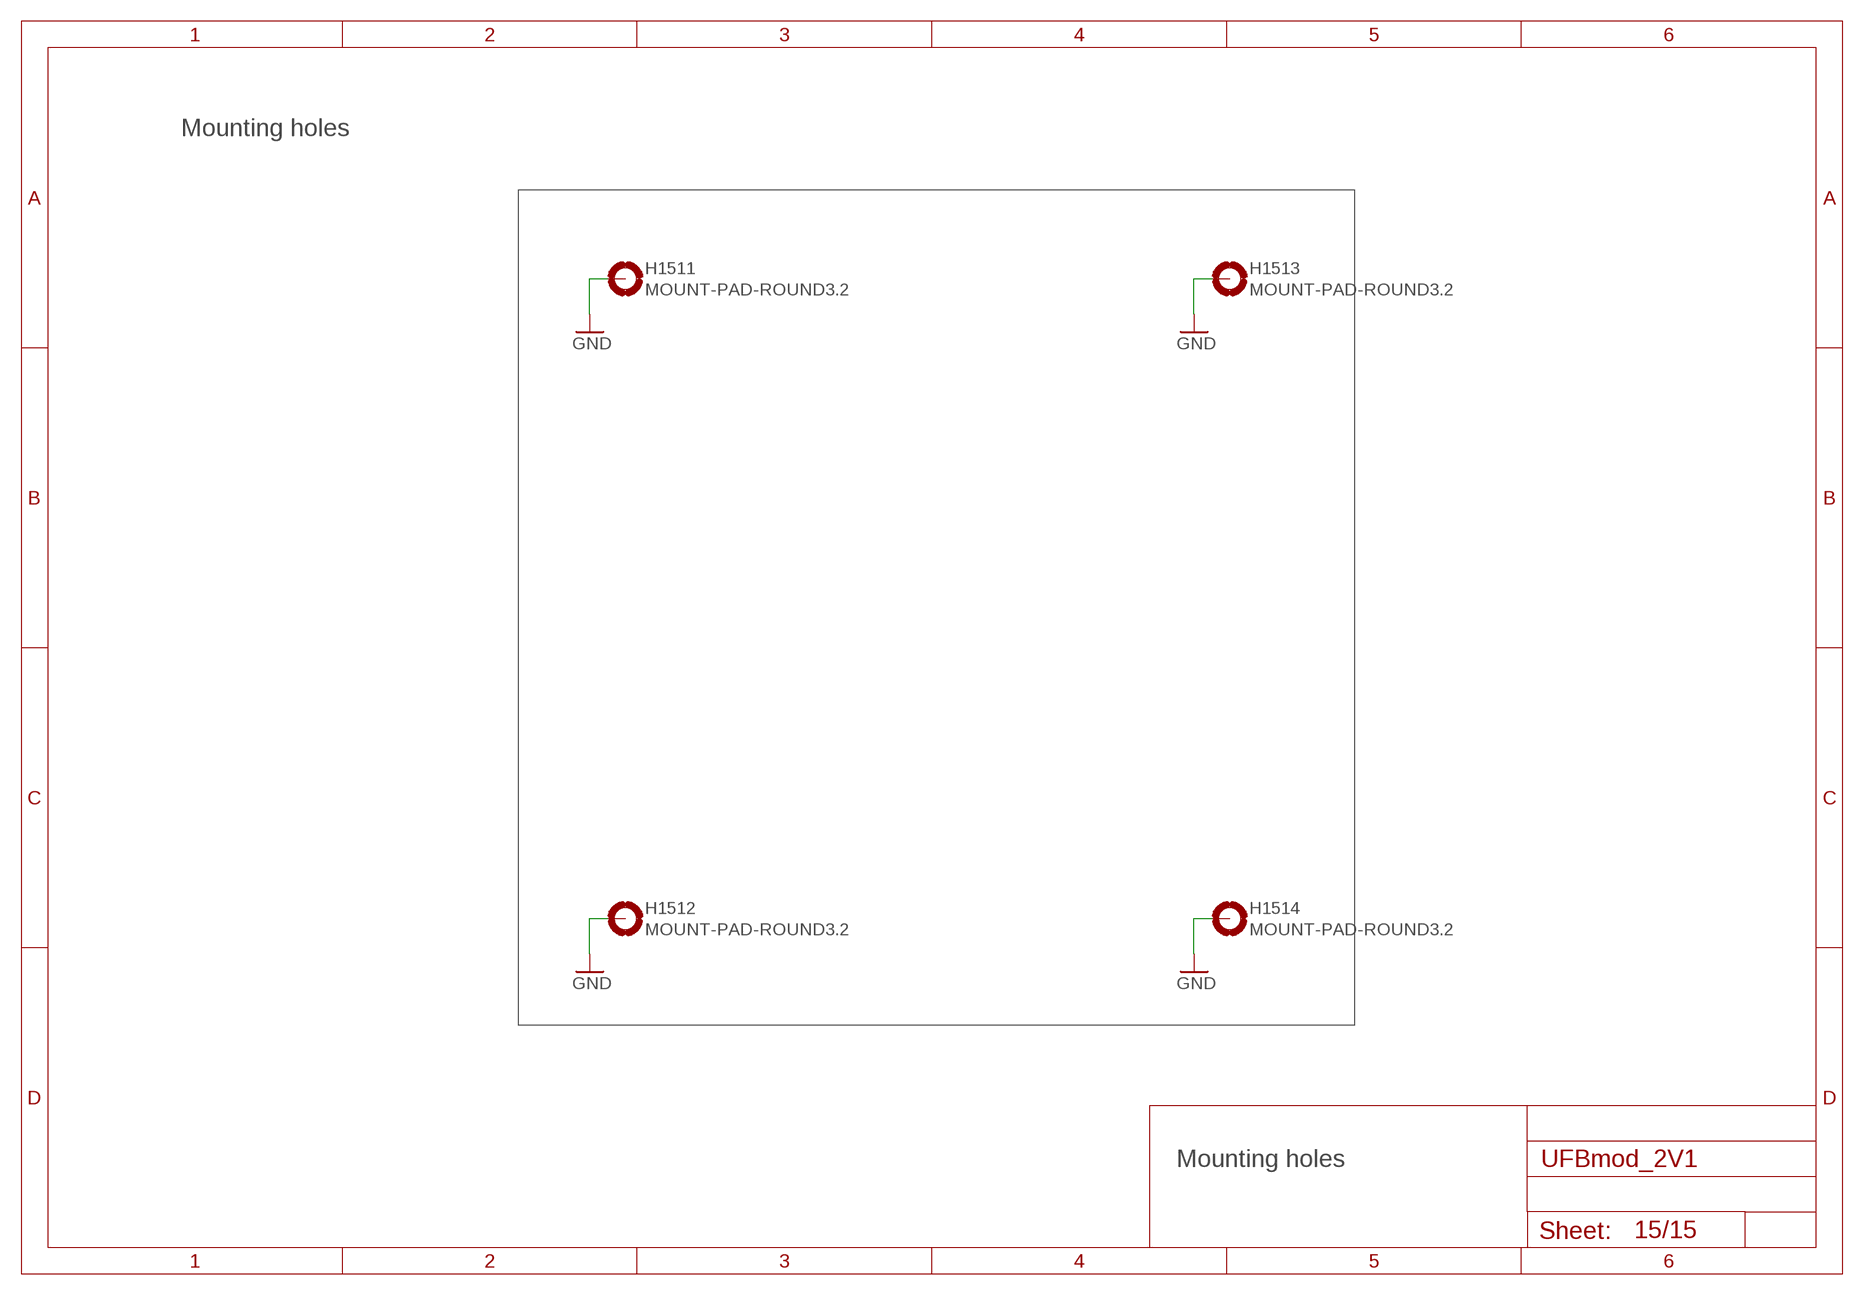
[diagram p14: schematic, sheet 15]

### Parts
H1511  MOUNT-PAD-ROUND3.2  [3,2-PAD]
H1512  MOUNT-PAD-ROUND3.2  [3,2-PAD]
H1513  MOUNT-PAD-ROUND3.2  [3,2-PAD]
H1514  MOUNT-PAD-ROUND3.2  [3,2-PAD]

### Nets
GND: H1511.B3,2(MOUNT) H1512.B3,2(MOUNT) H1513.B3,2(MOUNT) H1514.B3,2(MOUNT) ; also sheet 1,2,3,5,6,7,8,9,10,11,12,13,14

### Notes on the sheet
- Mounting holes
- Mounting holes

## Power pins joined to a net without a drawn wire
VBAT_IN: JB1.80(VBAT_IN)

## Library data of the parts
C0501 C0511 C0512 C0611 C0612 C0621 C0701 C0703 C0704 C0706-C0708 C0711-C0713 C0811 C0821 C0831 C0832 C0851-C0853 C0891 C0893 C0895 C0897 C0911-C0913 C0921 C0922 C1011-C1013 C1101 C1102 C1108 C1111-C1114 C1122 C1131 C1132 C1151-C1153 C1201 C1221 C1311 C1321 C1381 C1431 C1432 C1441 C1442 = df4iah_rcl:C-EU: CAPACITOR, European symbol
D0971 D0972 = df4iah_led:LED: LED OSRAM: - CHIPLED LG R971, LG N971, LY N971, LG Q971, LY Q971, LO R971, LY R971 LH N974, LH R974 LS Q976, LO Q976, LY Q976 LO Q996 - Hyper CHIPLED LW Q18S LB Q993, LB Q99A, LB R99A - SideLED LS A670, LO A670, LY A670, LG A670, LP A670 LB A673, LV A673, LT A673, LW A673 LH A674 LY A675 LS A676, LA A676, LO A676, LY A676, LW A676 LS A679, LY A679, LG A679 - Hyper Micro SIDELED® LS Y876, LA Y876, LO Y876, LY Y876 LT Y87S - SmartLED LW L88C, LW L88S LB L89C, LB L89S, LG L890 LS L89K, LO L89K, LY L89K LS L896, LA L896, LO L896, LY L896 - TOPLED LS T670, LO T670, LY T670, LG T670, LP T670 LSG T670, LSP T670, LSY T670, LOP T670, LYG T670 LG T671, LOG T671, LSG T671 LB T673, LV T673, LT T673, LW T673 LH T674 LS T676, LA T676, LO T676, LY T676, LB T676, LH T676, LSB T676, LW T676 LB T67C, LV T67C, LT T67C, LS T67K, LO T67K, LY T67K, LW E67C LS E67B, LA E67B, LO E67B, LY E67B, LB E67C, LV E67C, LT E67C LW T67C LS T679, LY T679, LG T679 LS T770, LO T770, LY T770, LG T770, LP T770 LB T773, LV T773, LT T773, LW T773 LH T774 LS E675, LA E675, LY E675, LS T675 LS T776, LA T776, LO T776, LY T776, LB T776 LHGB T686 LT T68C, LB T68C - Hyper Mini TOPLED® LB M676 - Mini TOPLED Santana® LG M470 LS M47K, LO M47K, LY M47K Source: http://www.osram.convergy.de LUXEON: - LUMILED® LXK2-PW12-R00, LXK2-PW12-S00, LXK2-PW14-U00, LXK2-PW14-V00 LXK2-PM12-R00, LXK2-PM12-S00, LXK2-PM14-U00 LXK2-PE12-Q00, LXK2-PE12-R00, LXK2-PE12-S00, LXK2-PE14-T00, LXK2-PE14-U00 LXK2-PB12-K00, LXK2-PB12-L00, LXK2-PB12-M00, LXK2-PB14-N00, LXK2-PB14-P00, LXK2-PB14-Q00 LXK2-PR12-L00, LXK2-PR12-M00, LXK2-PR14-Q00, LXK2-PR14-R00 LXK2-PD12-Q00, LXK2-PD12-R00, LXK2-PD12-S00 LXK2-PH12-R00, LXK2-PH12-S00 LXK2-PL12-P00, LXK2-PL12-Q00, LXK2-PL12-R00 Source: www.luxeon.com KINGBRIGHT: KA-3528ASYC Source: www.kingbright.com
D1021 = df4iah_led:ASMT-YTB7-0AA02_RGB: Broadcom ASMT-YTB7-0AA02 Tricolor PLCC6 Black Surface LED
D1111 D1112 D1161 = df4iah_diode:CRS08: SCHOTTKY BARRIER RECTIFIER
FPGA_EN1 FPGA_MODE PGOOD TP1371 TP_RESIN TP_RFX_DET TP_TXDEN = df4iah_connector:TP: Test pad
H1511-H1514 HB_351-HB_354 = df4iah_holes:MOUNT-PAD-ROUND: MOUNTING PAD, round
J1411 = df4iah_connector:ARJE-0034_RJ45_WITH_MAGNETICS: Abracon ARJE-0034 RJ-45 Jack with internal magnetics and 2x LEDs SMT 16.10 x 13.87 x 25.68 mm Compliant with IEEE802.3 standard 350 uH minimum OCL with 8mA bias current
JB1 = df4iah_connector:SAMTEC_LSHM-150-DV_JB1: SAMTEC LSHM-150-XX.X-X-DV-A-X-X-TR HIGH-SPEED HERMAPHRODITIC STRIP 100 Pos 0.5 mm padding
JB2 = df4iah_connector:SAMTEC_LSHM-150-DV_JB2: SAMTEC LSHM-150-XX.X-X-DV-A-X-X-TR HIGH-SPEED HERMAPHRODITIC STRIP 100 Pos 0.5 mm padding
JB3 = df4iah_connector:SAMTEC_LSHM-130-DV_JB3: SAMTEC LSHM-130-XX.X-X-DV-A-X-X-TR HIGH-SPEED HERMAPHRODITIC STRIP 60 Pos 0.5 mm padding
L0701-L0704 L0911 L0921 L0922 R0201-R0203 R0411 R0412 R0531 R0532 R0551-R0553 R0621 R0711 R0751-R0756 R0821 R0822 R0861-R0863 R0911-R0913 R0931 R0941 R0961-R0968 R0971 R0972 R1011-R1013 R1021-R1023 R1101-R1108 R1122 R1131 R1161 R1211 R1311 R1321 R1331-R1335 R1337-R1339 R1351-R1358 R1361-R1366 R1421 R1422 = df4iah_rcl:R-EU_: RESISTOR, European symbol
L0721 = df4iah_balun:DXW21HN5011BL: BALUN DXW21HN5011BL 2x coil transformer 2.00 mm x 1.20 mm
L0722 = df4iah_balun:2450BL15B050: BALUN: JOHANSON TECHNOLOGY 2450BL15B050 2.00 mm x 1.25 mm
L0821 L0853 L0892 L0896 L1101 L1211 = df4iah_rcl:L-EU: INDUCTOR, European symbol
PF1311 = rcl:R-EU_: RESISTOR, European symbol
S1321 = df4iah_switch:KSR223G_SMD_1POL: KSR223G KSR Series Subminiature Tact Switch for SMT
T0551 = transistor:BC846: NPN TRANSISTOR
U0501 = df4iah_lcd:MIDAS_MCCOG21605B6W-FPTLWI: MIDAS MCCOG21605B6W-FPTLWI 16 x 2 character dot matrix LCD controlled by I2C bus 3.3V
U0601 = df4iah_dac:MAX5217: Maxim Integrated MAX5217 DAC DAC 16 bit, I2C
U0701 = df4iah_rf:AT86RF215: Microchip Technology AT86RF215 Sub-1GHz/2.4GHz Transceiver and I/Q Radio for IEEE Std 802.15.4TM-2015 IEEE Std 802.15.4gTM-2012 ETSI TS 102 887-1
U0711 = df4iah_osc:ASVTX-13-D: Clock Oscillator ASVTX-13-D 3.3 V variant Voltage control 2.00 mm x 1.60 mm
U0811 = df4iah_rf:PE4259: pSemi PE4259 SPDT High Power UltraCMOS® 10 MHz–3.0 GHz RF Switch Low insertion loss: 0.35 dB @ 1000 MHz, 0.5 dB @ 2000 MHz Isolation of 30 dB @ 1000 MHz Typical input 1 dB compression point of +33.5 dBm 6-lead SC-70 package Reference: http://www.psemi.com/products/rf-switches/pe4259
U0821 = df4iah_rf:RFX1010: Skyworks RFX1010 Front-End 50 Ohms LNA & PA LNA: 12 dB / 14 dB PA: +27 dBm
U0881 = df4iah_rf:B3440: QUALCOMM B3440 SAW-Filter f0 = 869MHz B = 2 MHz 3mm x 3mm
U0911 = df4iah_dataconvertion:FTDI232H: FT232H SINGLE CHANNEL HI-SPEED USB TO MULTIPURPOSE UART/FIFO Single channel USB to serial / parallel ports with a variety of configurations. Entire USB protocol handled on the chip. No USB specific firmware programming required. USB 2.0 Hi-Speed (480Mbits/Second) and Full Speed (12Mbits/Second) compatible. Multi-Protocol Synchronous Serial Engine (MPSSE) to simplify synchronous serial protocol (USB to JTAG, I2C, SPI (MASTER) or bit-bang) design. UART transfer data rate up to 12Mbaud. (RS232 Data Rate limited by external level shifter). USB to asynchronous 245 FIFO mode for transfer data rate up to 8 Mbyte/Sec. USB to synchronous 245 parallel FIFO mode for transfers up to 40 Mbytes/Sec Supports a proprietary half duplex FT1248 interface with a configurable width, bi-directional data bus (1, 2, 4 or 8 bits wide).
U1101 = df4iah_powersupply:TPS53353: TPS53353 High-Efficiency 20-A Synchronous Buck SWIFT™ Converter With Eco-mode™ Conversion Input Voltage Range: 1.5 V to 15 V VDD Input Voltage Range: 4.5 V to 25 V 92% Efficiency From 12 V to 1.5 V at 20 A Output Voltage Range: 0.6 V to 5.5 V 5-V LDO Output Supports Single-Rail Input Integrated Power MOSFETs With 20 A of Continuous Output Current Auto-Skip Eco-mode™ for Light-Load Efficiency <10-μA Shutdown Current Precharged Start-up Capability Overvoltage, Undervoltage, UVLO and Overtemperature Protection
U1211 = df4iah_powersupply:TPS62745: TPS62745 Dual-cell Ultra Low IQ Step Down Converter for Low Power Wireless Applications Input Voltage Range VIN from 3.3 V to 10 V Typical 400 nA Quiescent Current Up to 90% efficiency with load currents >15 μA Up to 300 mA Output Current RF Friendly DCS-Control™ Low Output Ripple Voltage 16 Selectable Output Voltages from 1.8 V to 3.3 V (TPS62745) 1.3 V to 2.8 V (TPS627451) Integrated input voltage switch Integrated Discharge Function at VOUT Open Drain Power Good Output Operates with a Tiny 3.3 μH or 4.7 μH Inductor Small 3 mm x 2 mm WSON Package
X0891 X0895 = _c2h:ANTENNA: SMA Antenna Connector End launch SMA connector. The paste layer has been removed so that the connector can be hand soldered onto the board after reflow.
X1011 = df4iah_switch:TTE_EN11-HSM: TT-Electronics EN1-HSM Rotary Encoder with Switch
X1311 = df4iah_connector:USB_MICRO-B_MOLEX: USB Type Micro-B Connector Male/female and PTH/SMT variants Molex Products: Micro-USB B Receptacle, Bottom Mount, Surface Mount, with Solder Tabs, Lead-Free <http://www.molex.com/molex/products/datasheet.jsp?part=active/1050170001_IO_CONNECTORS.xml>
X1331 = df4iah_connector:XILINX-JTAG-14: Header 2X7 2.54mm, shrouded This header type is used as XILINX JTAG header for 14 positions.
X1332 = df4iah_connector:HEADER-1X2: Header 1X2 2.54mm
X1351 X1361 = df4iah_connector:PHOENIX_1990067_1X8X2MM50_PTSA-0-5: PCB terminal block - PTSA 0,5/8-2,5-Z - 1990067 PCB terminal block, nominal current: 2 A, nom. voltage: 250 V, pitch: 2.5 mm, number of positions: 8, connection method: Push-in spring connection, mounting: Wave soldering, conductor/PCB connection direction: 45 °
X1381 = df4iah_connector:HEADER-2X3: Header 2X3 2.54mm

## Net classes
0 default: width 0.127 mm, drill 0.3 mm, clearance 0.127 mm
1 diff_100R_200u: width 0.203 mm, drill 0.3 mm, clearance 0.203 mm
2 diff_100R_280u: width 0.229 mm, drill 0.3 mm, clearance 0.152 mm
3 diff_100R_360u: width 0.267 mm, drill 0.3 mm, clearance 0.152 mm
4 diff_90R_200u: width 0.216 mm, drill 0.3 mm, clearance 0.152 mm
5 diff_90R_280u: width 0.292 mm, drill 0.3 mm, clearance 0.152 mm
6 diff_90R_360u: width 0.318 mm, drill 0.3 mm, clearance 0.127 mm
7 uni_50R_200u: width 0.343 mm, drill 0.3 mm, clearance 0.381 mm
8 uni_50R_280u: width 0.483 mm, drill 0.3 mm, clearance 0.381 mm
9 uni_50R_360u: width 0.635 mm, drill 0.3 mm, clearance 0.381 mm
10 diff_50R_200u: width 0.508 mm, drill 0.3 mm, clearance 0.127 mm